# Altium project ZYNQ_Industrial_Data_Acquisition.PrjPcb (part 1 of 2)
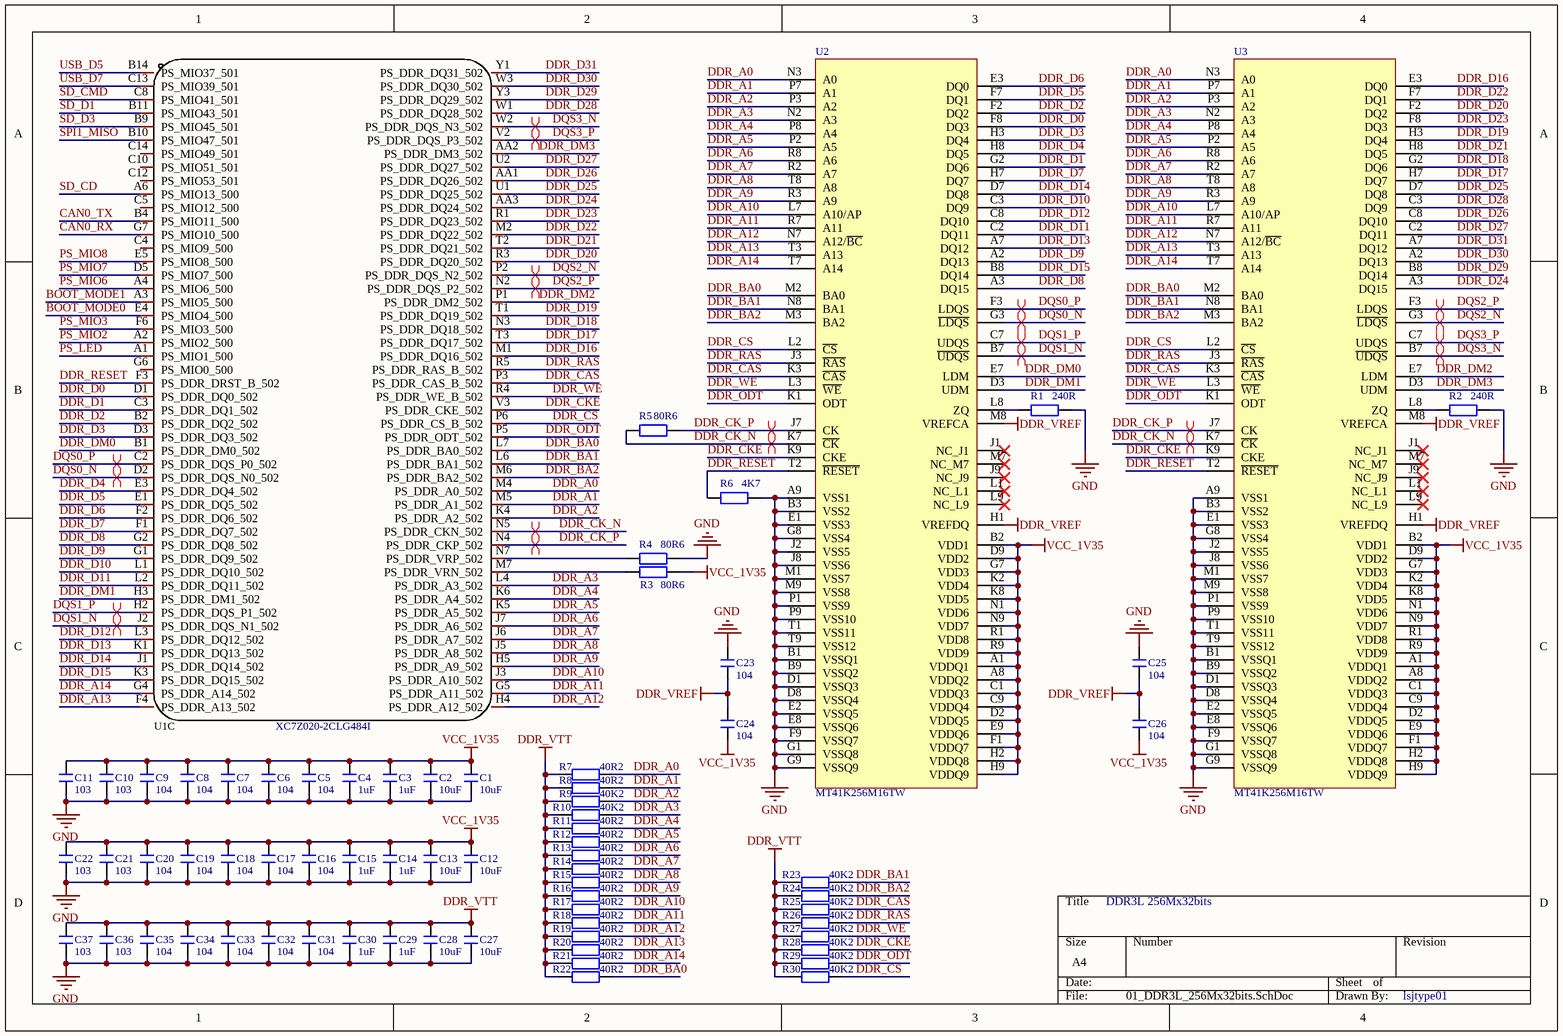
[diagram p0: 01_DDR3L_256Mx32bits.SchDoc]
10 sheets, 426 parts. Net scope: global (net labels, ports and power ports of the same name join across sheets).
Board file: IDA_Board_02_ver1.0.PcbDoc
Sheets:
  01_DDR3L_256Mx32bits.SchDoc
  02_ZYNQ_POWER.SchDoc
  03_SYS_POWER.SchDoc
  04_ZYNQ_BANK13_33_34.SchDoc
  05_ZYNQ_BANK0_1_34_35.SchDoc
  06_CAN&RS485.SchDoc
  07_FE_SWITCHING.SchDoc
  08_HDMI.SchDoc
  09_TFCARD&USB2.0.SchDoc
  10_FE_LANPORT.SchDoc

## Sheet 01_DDR3L_256Mx32bits.SchDoc
size A4; SheetNumber: 2; SheetTotal: 11

### Parts
C1  10uF  [C 0603]
C2  10uF  [C 0603]
C3  1uF  [C 0402]
C4  1uF  [C 0402]
C5  104  [C 0402]
C6  104  [C 0402]
C7  104  [C 0402]
C8  104  [C 0402]
C9  104  [C 0402]
C10  103  [C 0402]
C11  103  [C 0402]
C12  10uF  [C 0603]
C13  10uF  [C 0603]
C14  1uF  [C 0402]
C15  1uF  [C 0402]
C16  104  [C 0402]
C17  104  [C 0402]
C18  104  [C 0402]
C19  104  [C 0402]
C20  104  [C 0402]
C21  103  [C 0402]
C22  103  [C 0402]
C23  104  [C 0402]
C24  104  [C 0402]
C25  104  [C 0402]
C26  104  [C 0402]
C27  10uF  [C 0603]
C28  10uF  [C 0603]
C29  1uF  [C 0402]
C30  1uF  [C 0402]
C31  104  [C 0402]
C32  104  [C 0402]
C33  104  [C 0402]
C34  104  [C 0402]
C35  104  [C 0402]
C36  103  [C 0402]
C37  103  [C 0402]
R1  240R  [R 0402]
R2  240R  [R 0402]
R3  80R6  [R 0402]
R4  80R6  [R 0402]
R5  80R6  [R 0402]
R6  4K7  [R 0402]
R7  40R2  [R 0402]
R8  40R2  [R 0402]
R9  40K2  [R 0402]
R10  40K2  [R 0402]
R11  40R2  [R 0402]
R12  40R2  [R 0402]
R13  40R2  [R 0402]
R14  40R2  [R 0402]
R15  40R2  [R 0402]
R16  40R2  [R 0402]
R17  40R2  [R 0402]
R18  40R2  [R 0402]
R19  40R2  [R 0402]
R20  40R2  [R 0402]
R21  40R2  [R 0402]
R22  40R2  [R 0402]
R23  40K2  [R 0402]
R24  40K2  [R 0402]
R25  40K2  [R 0402]
R26  40K2  [R 0402]
R27  40K2  [R 0402]
R28  40K2  [R 0402]
R29  40K2  [R 0402]
R30  40K2  [R 0402]
U1  XC7Z020-2CLG484I  [CSPBGA-484]  (part C of 4)
U2  MT41K256M16TW  [FBGA_96]
U3  MT41K256M16TW  [FBGA_96]

### Nets
DDR_VREF: C23.2 C24.1 C25.2 C26.1 U2.H1(VREFDQ) U2.M8(VREFCA) U3.H1(VREFDQ) U3.M8(VREFCA)
DDR_VTT: C27.2 C28.1 C29.1 C30.1 C31.1 C32.1 C33.1 C34.1 C35.1 C36.1 C37.1 R7.1 R8.1 R9.1 R10.1 R11.1 R12.1 R13.1 R14.1 R15.1 R16.1 R17.1 R18.1 R19.1 R20.1 R21.1 R22.1 R23.1 R24.1 R25.1 R26.1 R27.1 R28.1 R29.1 R30.1
GND: C1.1 C2.1 C3.1 C4.1 C5.1 C6.1 C7.1 C8.1 C9.1 C10.1 C11.1 C12.1 C13.1 C14.1 C15.1 C16.1 C17.1 C18.1 C19.1 C20.1 C21.1 C22.1 C23.1 C25.1 C27.1 C28.2 C29.2 C30.2 C31.2 C32.2 C33.2 C34.2 C35.2 C36.2 C37.2 R1.2 R2.2 R4.2 R6.1 U2.A9(VSS1) U2.B1(VSSQ1) U2.B3(VSS2) U2.B9(VSSQ2) U2.D1(VSSQ3) U2.D8(VSSQ4) U2.E1(VSS3) U2.E2(VSSQ5) U2.E8(VSSQ6) U2.F9(VSSQ7) U2.G1(VSSQ8) U2.G8(VSS4) U2.G9(VSSQ9) U2.J2(VSS5) U2.J8(VSS6) U2.M1(VSS7) U2.M9(VSS8) U2.P1(VSS9) U2.P9(VSS10) U2.T1(VSS11) U2.T9(VSS12) U3.A9(VSS1) U3.B1(VSSQ1) U3.B3(VSS2) U3.B9(VSSQ2) U3.D1(VSSQ3) U3.D8(VSSQ4) U3.E1(VSS3) U3.E2(VSSQ5) U3.E8(VSSQ6) U3.F9(VSSQ7) U3.G1(VSSQ8) U3.G8(VSS4) U3.G9(VSSQ9) U3.J2(VSS5) U3.J8(VSS6) U3.M1(VSS7) U3.M9(VSS8) U3.P1(VSS9) U3.P9(VSS10) U3.T1(VSS11) U3.T9(VSS12)
VCC_1V35: C1.2 C2.2 C3.2 C4.2 C5.2 C6.2 C7.2 C8.2 C9.2 C10.2 C11.2 C12.2 C13.2 C14.2 C15.2 C16.2 C17.2 C18.2 C19.2 C20.2 C21.2 C22.2 C24.2 C26.2 R3.2 U2.A1(VDDQ1) U2.A8(VDDQ2) U2.B2(VDD1) U2.C1(VDDQ3) U2.C9(VDDQ4) U2.D2(VDDQ5) U2.D9(VDD2) U2.E9(VDDQ6) U2.F1(VDDQ7) U2.G7(VDD3) U2.H2(VDDQ8) U2.H9(VDDQ9) U2.K2(VDD4) U2.K8(VDD5) U2.N1(VDD6) U2.N9(VDD7) U2.R1(VDD8) U2.R9(VDD9) U3.A1(VDDQ1) U3.A8(VDDQ2) U3.B2(VDD1) U3.C1(VDDQ3) U3.C9(VDDQ4) U3.D2(VDDQ5) U3.D9(VDD2) U3.E9(VDDQ6) U3.F1(VDDQ7) U3.G7(VDD3) U3.H2(VDDQ8) U3.H9(VDDQ9) U3.K2(VDD4) U3.K8(VDD5) U3.N1(VDD6) U3.N9(VDD7) U3.R1(VDD8) U3.R9(VDD9)
BOOT_MODE0: U1.E4(PS_MIO4_500)
BOOT_MODE1: U1.A3(PS_MIO5_500)
CAN0_RX: U1.G7(PS_MIO10_500)
CAN0_TX: U1.B4(PS_MIO11_500)
DDR_A0: R7.2 U1.M4(PS_DDR_A0_502) U2.N3(A0) U3.N3(A0)
DDR_A1: R8.2 U1.M5(PS_DDR_A1_502) U2.P7(A1) U3.P7(A1)
DDR_A2: R9.2 U1.K4(PS_DDR_A2_502) U2.P3(A2) U3.P3(A2)
DDR_A3: R10.2 U1.L4(PS_DDR_A3_502) U2.N2(A3) U3.N2(A3)
DDR_A4: R11.2 U1.K6(PS_DDR_A4_502) U2.P8(A4) U3.P8(A4)
DDR_A5: R12.2 U1.K5(PS_DDR_A5_502) U2.P2(A5) U3.P2(A5)
DDR_A6: R13.2 U1.J7(PS_DDR_A6_502) U2.R8(A6) U3.R8(A6)
DDR_A7: R14.2 U1.J6(PS_DDR_A7_502) U2.R2(A7) U3.R2(A7)
DDR_A8: R15.2 U1.J5(PS_DDR_A8_502) U2.T8(A8) U3.T8(A8)
DDR_A9: R16.2 U1.H5(PS_DDR_A9_502) U2.R3(A9) U3.R3(A9)
DDR_A10: R17.2 U1.J3(PS_DDR_A10_502) U2.L7(A10/AP) U3.L7(A10/AP)
DDR_A11: R18.2 U1.G5(PS_DDR_A11_502) U2.R7(A11) U3.R7(A11)
DDR_A12: R19.2 U1.H4(PS_DDR_A12_502) U2.N7(A12/~{BC}) U3.N7(A12/~{BC})
DDR_A13: R20.2 U1.F4(PS_DDR_A13_502) U2.T3(A13) U3.T3(A13)
DDR_A14: R21.2 U1.G4(PS_DDR_A14_502) U2.T7(A14) U3.T7(A14)
DDR_BA0: R22.2 U1.L7(PS_DDR_BA0_502) U2.M2(BA0) U3.M2(BA0)
DDR_BA1: R23.2 U1.L6(PS_DDR_BA1_502) U2.N8(BA1) U3.N8(BA1)
DDR_BA2: R24.2 U1.M6(PS_DDR_BA2_502) U2.M3(BA2) U3.M3(BA2)
DDR_CAS: R25.2 U1.P3(PS_DDR_CAS_B_502) U2.K3(~{CAS}) U3.K3(~{CAS})
DDR_CK_N: R5.2 U1.N5(PS_DDR_CKN_502) U2.K7(~{CK}) U3.K7(~{CK})
DDR_CK_P: R5.1 U1.N4(PS_DDR_CKP_502) U2.J7(CK) U3.J7(CK)
DDR_CKE: R28.2 U1.V3(PS_DDR_CKE_502) U2.K9(CKE) U3.K9(CKE)
DDR_CS: R30.2 U1.P6(PS_DDR_CS_B_502) U2.L2(~{CS}) U3.L2(~{CS})
DDR_D0: U1.D1(PS_DDR_DQ0_502) U2.F8(DQ3)
DDR_D1: U1.C3(PS_DDR_DQ1_502) U2.G2(DQ6)
DDR_D2: U1.B2(PS_DDR_DQ2_502) U2.F2(DQ2)
DDR_D3: U1.D3(PS_DDR_DQ3_502) U2.H3(DQ4)
DDR_D4: U1.E3(PS_DDR_DQ4_502) U2.H8(DQ5)
DDR_D5: U1.E1(PS_DDR_DQ5_502) U2.F7(DQ1)
DDR_D6: U1.F2(PS_DDR_DQ6_502) U2.E3(DQ0)
DDR_D7: U1.F1(PS_DDR_DQ7_502) U2.H7(DQ7)
DDR_D8: U1.G2(PS_DDR_DQ8_502) U2.A3(DQ15)
DDR_D9: U1.G1(PS_DDR_DQ9_502) U2.A2(DQ13)
DDR_D10: U1.L1(PS_DDR_DQ10_502) U2.C3(DQ9)
DDR_D11: U1.L2(PS_DDR_DQ11_502) U2.C2(DQ11)
DDR_D12: U1.L3(PS_DDR_DQ12_502) U2.C8(DQ10)
DDR_D13: U1.K1(PS_DDR_DQ13_502) U2.A7(DQ12)
DDR_D14: U1.J1(PS_DDR_DQ14_502) U2.D7(DQ8)
DDR_D15: U1.K3(PS_DDR_DQ15_502) U2.B8(DQ14)
DDR_D16: U1.M1(PS_DDR_DQ16_502) U3.E3(DQ0)
DDR_D17: U1.T3(PS_DDR_DQ17_502) U3.H7(DQ7)
DDR_D18: U1.N3(PS_DDR_DQ18_502) U3.G2(DQ6)
DDR_D19: U1.T1(PS_DDR_DQ19_502) U3.H3(DQ4)
DDR_D20: U1.R3(PS_DDR_DQ20_502) U3.F2(DQ2)
DDR_D21: U1.T2(PS_DDR_DQ21_502) U3.H8(DQ5)
DDR_D22: U1.M2(PS_DDR_DQ22_502) U3.F7(DQ1)
DDR_D23: U1.R1(PS_DDR_DQ23_502) U3.F8(DQ3)
DDR_D24: U1.AA3(PS_DDR_DQ24_502) U3.A3(DQ15)
DDR_D25: U1.U1(PS_DDR_DQ25_502) U3.D7(DQ8)
DDR_D26: U1.AA1(PS_DDR_DQ26_502) U3.C8(DQ10)
DDR_D27: U1.U2(PS_DDR_DQ27_502) U3.C2(DQ11)
DDR_D28: U1.W1(PS_DDR_DQ28_502) U3.C3(DQ9)
DDR_D29: U1.Y3(PS_DDR_DQ29_502) U3.B8(DQ14)
DDR_D30: U1.W3(PS_DDR_DQ30_502) U3.A2(DQ13)
DDR_D31: U1.Y1(PS_DDR_DQ31_502) U3.A7(DQ12)
DDR_DM0: U1.B1(PS_DDR_DM0_502) U2.E7(LDM)
DDR_DM1: U1.H3(PS_DDR_DM1_502) U2.D3(UDM)
DDR_DM2: U1.P1(PS_DDR_DM2_502) U3.E7(LDM)
DDR_DM3: U1.AA2(PS_DDR_DM3_502) U3.D3(UDM)
DDR_ODT: R29.2 U1.P5(PS_DDR_ODT_502) U2.K1(ODT) U3.K1(ODT)
DDR_RAS: R26.2 U1.R5(PS_DDR_RAS_B_502) U2.J3(~{RAS}) U3.J3(~{RAS})
DDR_RESET: R6.2 U1.F3(PS_DDR_DRST_B_502) U2.T2(~{RESET}) U3.T2(~{RESET})
DDR_WE: R27.2 U1.R4(PS_DDR_WE_B_502) U2.L3(~{WE}) U3.L3(~{WE})
DQS0_N: U1.D2(PS_DDR_DQS_N0_502) U2.G3(~{LDQS})
DQS0_P: U1.C2(PS_DDR_DQS_P0_502) U2.F3(LDQS)
DQS1_N: U1.J2(PS_DDR_DQS_N1_502) U2.B7(~{UDQS})
DQS1_P: U1.H2(PS_DDR_DQS_P1_502) U2.C7(UDQS)
DQS2_N: U1.P2(PS_DDR_DQS_N2_502) U3.G3(~{LDQS})
DQS2_P: U1.N2(PS_DDR_DQS_P2_502) U3.F3(LDQS)
DQS3_N: U1.W2(PS_DDR_DQS_N3_502) U3.B7(~{UDQS})
DQS3_P: U1.V2(PS_DDR_DQS_P3_502) U3.C7(UDQS)
PS_LED: U1.A1(PS_MIO1_500)
PS_MIO2: U1.A2(PS_MIO2_500)
PS_MIO3: U1.F6(PS_MIO3_500)
PS_MIO6: U1.A4(PS_MIO6_500)
PS_MIO7: U1.D5(PS_MIO7_500)
PS_MIO8: U1.E5(PS_MIO8_500)
SD_CD: U1.A6(PS_MIO13_500)
SD_CMD: U1.C8(PS_MIO41_501)
SD_D1: U1.B11(PS_MIO43_501)
SD_D3: U1.B9(PS_MIO45_501)
SPI1_MISO: U1.B10(PS_MIO47_501)
USB_D5: U1.B14(PS_MIO37_501)
USB_D7: U1.C13(PS_MIO39_501)
NetR1_1: R1.1 U2.L8(ZQ)
NetR2_1: R2.1 U3.L8(ZQ)
NetR3_1: R3.1 U1.M7(PS_DDR_VRN_502)
NetR4_1: R4.1 U1.N7(PS_DDR_VRP_502)

Not connected (* = marked no-connect by the designer): U1 C4(PS_MIO9_500) C5(PS_MIO12_500) C10(PS_MIO51_501) C12(PS_MIO53_501) C14(PS_MIO49_501) G6(PS_MIO0_500); U2 J1(NC_J1)* J9(NC_J9)* L1(NC_L1)* L9(NC_L9)* M7(NC_M7)*; U3 J1(NC_J1)* J9(NC_J9)* L1(NC_L1)* L9(NC_L9)* M7(NC_M7)*

### Layout directives
differential pair: DDR_CK_N, DDR_CK_P, DQS0_N, DQS0_P, DQS1_N, DQS1_P, DQS2_N, DQS2_P, DQS3_N, DQS3_P

### Notes on the sheet
- DDR3L 256Mx32bits
- lsjtype01

### Library data of the parts
C1-C37 = C: 无极性贴片电容; 版权归属: 源创客; BOM名称: 无极性贴片电容; 学习资源: www.ooocke.com
R1-R30 = R: 贴片电阻; 版权归属: 源创客; BOM名称: 贴片电阻; 学习资源: www.ooocke.com
U1 = XC7Z020-2CLG484I: Manufacturer: XILINX(赛灵思); Add into BOM: yes; Paste Type: expand; Name: XC7Z020-2CLG484I; Symbol: XC7Z020-2CLG484I; Device: XC7Z020-2CLG484I; LCSC Part Name: XC7Z020-2CLG484I; Supplier Part: C157624; Manufacturer Part: XC7Z020-2CLG484I; Supplier Footprint: CSPBGA-484; JLCPCB Part Class: Extended Part; Datasheet: https://atta.szlcsc.com/upload/public/pdf/source/20180115/C157624_15160149665121269420.pdf; Supplier: LCSC; Convert to PCB: yes; Assembly Type: smtWeld

## Sheet 02_ZYNQ_POWER.SchDoc
size A4; SheetNumber: 3; SheetTotal: 11
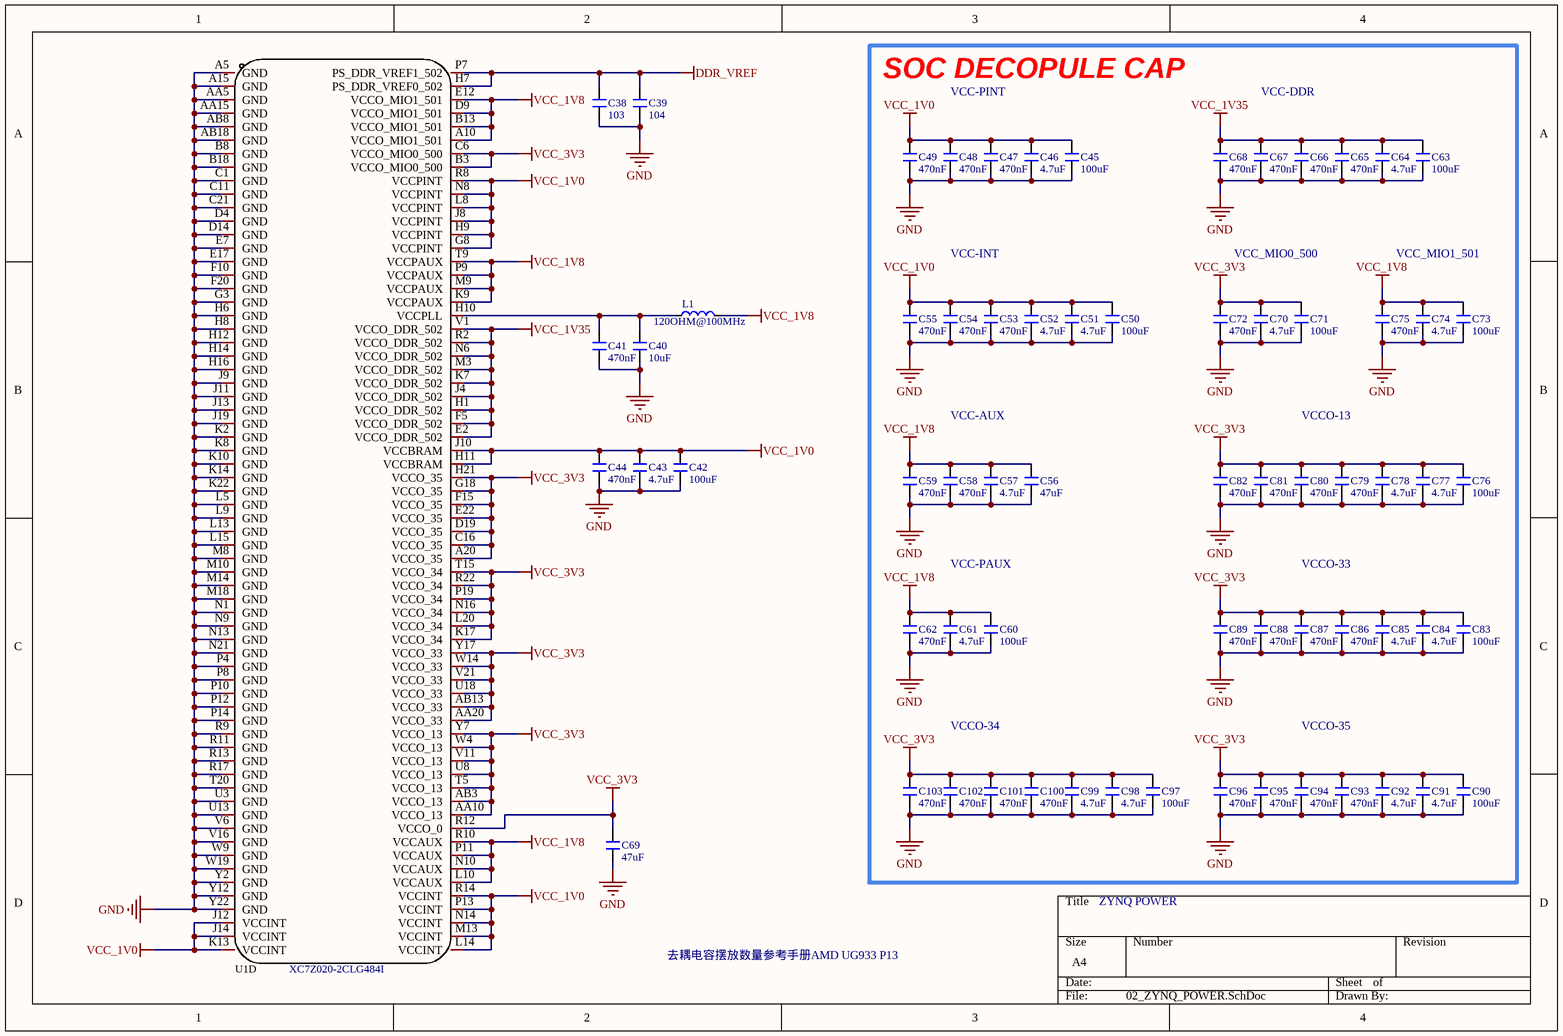
[diagram p1: 02_ZYNQ_POWER.SchDoc]

### Parts
C38  103  [C 0402]
C39  104  [C 0402]
C40  10uF  [C 0402]
C41  470nF  [C 0402]
C42  100uF  [C 0805]
C43  4.7uF  [C 0402]
C44  470nF  [C 0402]
C45  100uF  [C 0805]
C46  4.7uF  [C 0402]
C47  470nF  [C 0402]
C48  470nF  [C 0402]
C49  470nF  [C 0402]
C50  100uF  [C 0805]
C51  4.7uF  [C 0402]
C52  4.7uF  [C 0402]
C53  470nF  [C 0402]
C54  470nF  [C 0402]
C55  470nF  [C 0402]
C56  47uF  [C 0805]
C57  4.7uF  [C 0402]
C58  470nF  [C 0402]
C59  470nF  [C 0402]
C60  100uF  [C 0805]
C61  4.7uF  [C 0402]
C62  470nF  [C 0402]
C63  100uF  [C 0805]
C64  4.7uF  [C 0402]
C65  470nF  [C 0402]
C66  470nF  [C 0402]
C67  470nF  [C 0402]
C68  470nF  [C 0402]
C69  47uF  [C 0805]
C70  4.7uF  [C 0402]
C71  100uF  [C 0805]
C72  470nF  [C 0402]
C73  100uF  [C 0805]
C74  4.7uF  [C 0402]
C75  470nF  [C 0402]
C76  100uF  [C 0805]
C77  4.7uF  [C 0402]
C78  4.7uF  [C 0402]
C79  470nF  [C 0402]
C80  470nF  [C 0402]
C81  470nF  [C 0402]
C82  470nF  [C 0402]
C83  100uF  [C 0805]
C84  4.7uF  [C 0402]
C85  4.7uF  [C 0402]
C86  470nF  [C 0402]
C87  470nF  [C 0402]
C88  470nF  [C 0402]
C89  470nF  [C 0402]
C90  100uF  [C 0805]
C91  4.7uF  [C 0402]
C92  4.7uF  [C 0402]
C93  470nF  [C 0402]
C94  470nF  [C 0402]
C95  470nF  [C 0402]
C96  470nF  [C 0402]
C97  100uF  [C 0805]
C98  4.7uF  [C 0402]
C99  4.7uF  [C 0402]
C100  470nF  [C 0402]
C101  470nF  [C 0402]
C102  470nF  [C 0402]
C103  470nF  [C 0402]
L1  120OHM@100MHz  [L 0603]
U1  XC7Z020-2CLG484I  [FPBGA-484_L19.0-W19.0-R22-C22-P0.80-BL]  (part D of 4)

### Blocks framed on the sheet
SOC DECOPULE CAP: C45-C68 C70-C103

### Nets
DDR_VREF: C38.2 C39.2 U1.H7(PS_DDR_VREF0_502) U1.P7(PS_DDR_VREF1_502)
GND: C38.1 C39.1 C40.1 C41.1 C42.1 C43.1 C44.1 C45.1 C46.1 C47.1 C48.1 C49.1 C50.1 C51.1 C52.1 C53.1 C54.1 C55.1 C56.1 C57.1 C58.1 C59.1 C60.1 C61.1 C62.1 C63.1 C64.1 C65.1 C66.1 C67.1 C68.1 C69.1 C70.1 C71.1 C72.1 C73.1 C74.1 C75.1 C76.1 C77.1 C78.1 C79.1 C80.1 C81.1 C82.1 C83.1 C84.1 C85.1 C86.1 C87.1 C88.1 C89.1 C90.1 C91.1 C92.1 C93.1 C94.1 C95.1 C96.1 C97.1 C98.1 C99.1 C100.1 C101.1 C102.1 C103.1 U1.A5(GND) U1.A15(GND) U1.AA5(GND) U1.AA15(GND) U1.AB8(GND) U1.AB18(GND) U1.B8(GND) U1.B18(GND) U1.C1(GND) U1.C11(GND) U1.C21(GND) U1.D4(GND) U1.D14(GND) U1.E7(GND) U1.E17(GND) U1.F10(GND) U1.F20(GND) U1.G3(GND) U1.H6(GND) U1.H8(GND) U1.H12(GND) U1.H14(GND) U1.H16(GND) U1.J9(GND) U1.J11(GND) U1.J13(GND) U1.J19(GND) U1.K2(GND) U1.K8(GND) U1.K10(GND) U1.K14(GND) U1.K22(GND) U1.L5(GND) U1.L9(GND) U1.L13(GND) U1.L15(GND) U1.M8(GND) U1.M10(GND) U1.M14(GND) U1.M18(GND) U1.N1(GND) U1.N9(GND) U1.N13(GND) U1.N21(GND) U1.P4(GND) U1.P8(GND) U1.P10(GND) U1.P12(GND) U1.P14(GND) U1.R9(GND) U1.R11(GND) U1.R13(GND) U1.R17(GND) U1.T20(GND) U1.U3(GND) U1.U13(GND) U1.V6(GND) U1.V16(GND) U1.W9(GND) U1.W19(GND) U1.Y2(GND) U1.Y12(GND) U1.Y22(GND)
VCC_1V0: C42.2 C43.2 C44.2 C45.2 C46.2 C47.2 C48.2 C49.2 C50.2 C51.2 C52.2 C53.2 C54.2 C55.2 U1.G8(VCCPINT) U1.H9(VCCPINT) U1.H11(VCCBRAM) U1.J8(VCCPINT) U1.J10(VCCBRAM) U1.J12(VCCINT) U1.J14(VCCINT) U1.K13(VCCINT) U1.L8(VCCPINT) U1.L14(VCCINT) U1.M13(VCCINT) U1.N8(VCCPINT) U1.N14(VCCINT) U1.P13(VCCINT) U1.R8(VCCPINT) U1.R14(VCCINT)
VCC_1V8: C56.2 C57.2 C58.2 C59.2 C60.2 C61.2 C62.2 C73.2 C74.2 C75.2 L1.2 U1.A10(VCCO_MIO1_501) U1.B13(VCCO_MIO1_501) U1.D9(VCCO_MIO1_501) U1.E12(VCCO_MIO1_501) U1.K9(VCCPAUX) U1.L10(VCCAUX) U1.M9(VCCPAUX) U1.N10(VCCAUX) U1.P9(VCCPAUX) U1.P11(VCCAUX) U1.R10(VCCAUX) U1.T9(VCCPAUX)
VCC_1V35: C63.2 C64.2 C65.2 C66.2 C67.2 C68.2 U1.E2(VCCO_DDR_502) U1.F5(VCCO_DDR_502) U1.H1(VCCO_DDR_502) U1.J4(VCCO_DDR_502) U1.K7(VCCO_DDR_502) U1.M3(VCCO_DDR_502) U1.N6(VCCO_DDR_502) U1.R2(VCCO_DDR_502) U1.V1(VCCO_DDR_502)
VCC_3V3: C69.2 C70.2 C71.2 C72.2 C76.2 C77.2 C78.2 C79.2 C80.2 C81.2 C82.2 C83.2 C84.2 C85.2 C86.2 C87.2 C88.2 C89.2 C90.2 C91.2 C92.2 C93.2 C94.2 C95.2 C96.2 C97.2 C98.2 C99.2 C100.2 C101.2 C102.2 C103.2 U1.A20(VCCO_35) U1.AA10(VCCO_13) U1.AA20(VCCO_33) U1.AB3(VCCO_13) U1.AB13(VCCO_33) U1.B3(VCCO_MIO0_500) U1.C6(VCCO_MIO0_500) U1.C16(VCCO_35) U1.D19(VCCO_35) U1.E22(VCCO_35) U1.F15(VCCO_35) U1.G18(VCCO_35) U1.H21(VCCO_35) U1.K17(VCCO_34) U1.L20(VCCO_34) U1.N16(VCCO_34) U1.P19(VCCO_34) U1.R12(VCCO_0) U1.R22(VCCO_34) U1.T5(VCCO_13) U1.T15(VCCO_34) U1.U8(VCCO_13) U1.U18(VCCO_33) U1.V11(VCCO_13) U1.V21(VCCO_33) U1.W4(VCCO_13) U1.W14(VCCO_33) U1.Y7(VCCO_13) U1.Y17(VCCO_33)
NetC40_2: C40.2 C41.2 L1.1 U1.H10(VCCPLL)

### Notes on the sheet
- VCC-PINT
- VCC-DDR
- VCC-INT
- VCC_MIO0_500
- VCC_MIO1_501
- VCC-AUX
- VCCO-13
- VCC-PAUX
- VCCO-33
- VCCO-34
- VCCO-35
- ZYNQ POWER
- 去耦电容摆放数量参考手册AMD UG933 P13

### Library data of the parts
C38-C103 = C: 无极性贴片电容; 版权归属: 源创客; BOM名称: 无极性贴片电容; 学习资源: www.ooocke.com
L1 = L: 小功率贴片电感磁珠; 版权归属: 源创客; BOM名称: 小功率贴片电感; 学习资源: www.ooocke.com
U1 = XC7Z020-2CLG484I: as U1 on sheet 01_DDR3L_256Mx32bits; Name: XC7Z020-2CLG484I; Symbol: XC7Z020-2CLG484I; Device: XC7Z020-2CLG484I; LCSC Part Name: XC7Z020-2CLG484I; Supplier Part: C157624; Manufacturer Part: XC7Z020-2CLG484I; Supplier Footprint: CSPBGA-484; JLCPCB Part Class: Extended Part; Datasheet: https://atta.szlcsc.com/upload/public/pdf/source/20180115/C157624_15160149665121269420.pdf; Supplier: LCSC; Convert to PCB: yes; Assembly Type: smtWeld

## Sheet 03_SYS_POWER.SchDoc
size A4; SheetNumber: 4; SheetTotal: 11
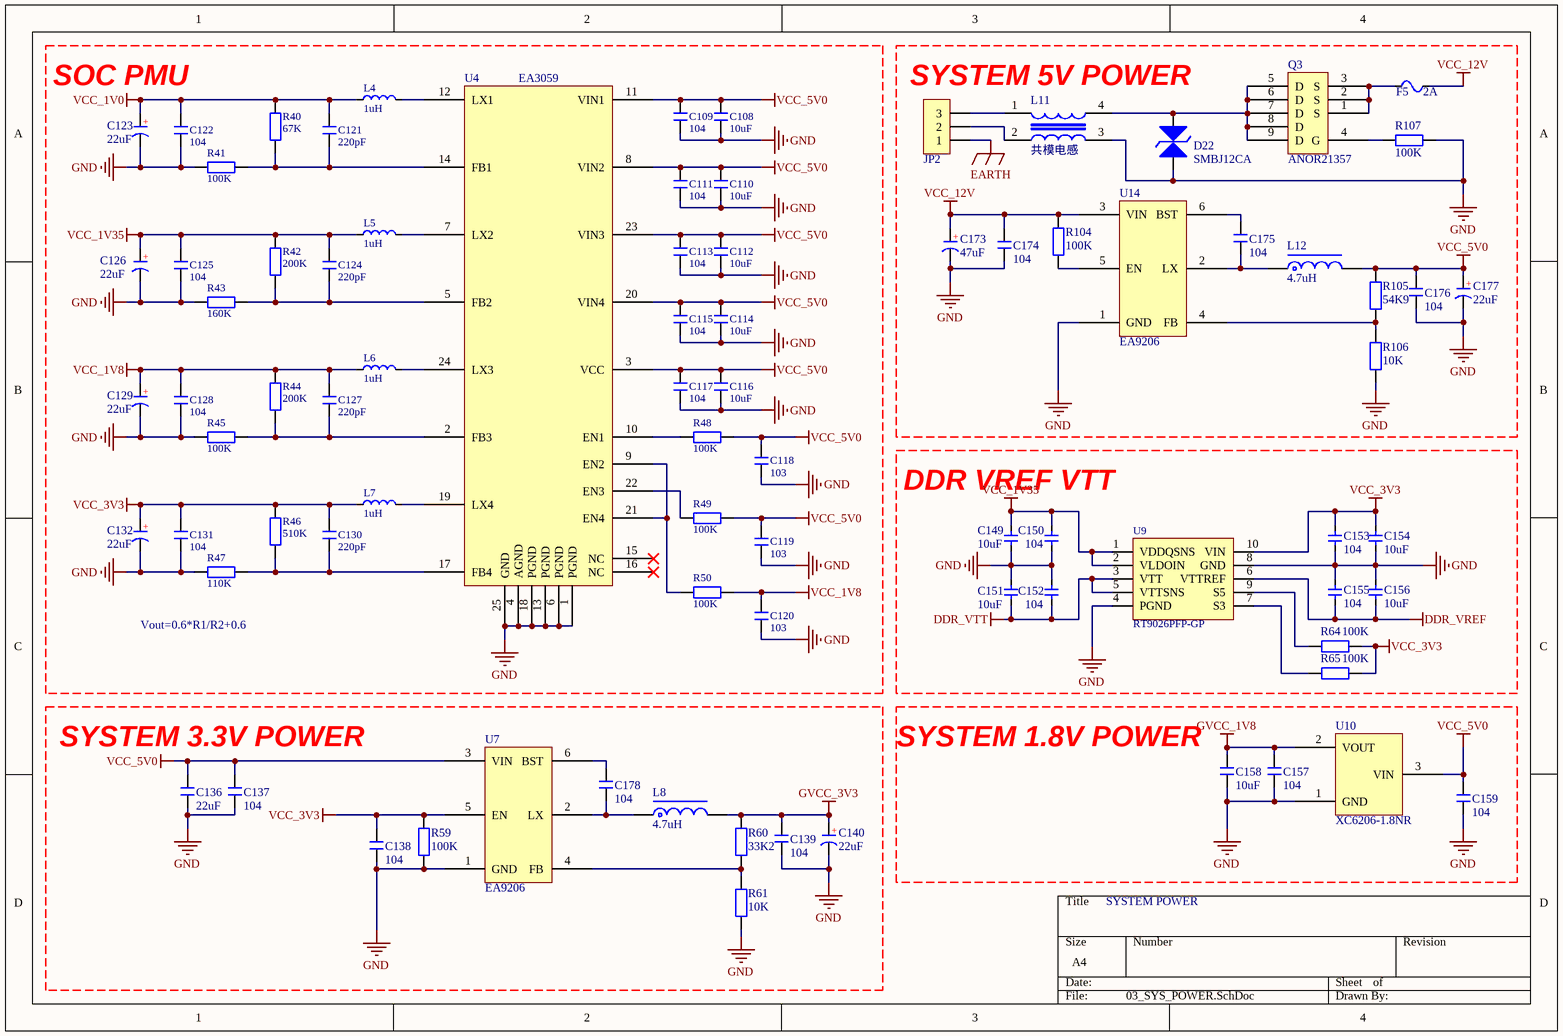
[diagram p2: 03_SYS_POWER.SchDoc]

### Parts
C108  10uF  [C 0805]
C109  104  [C 0603]
C110  10uF  [C 0805]
C111  104  [C 0603]
C112  10uF  [C 0805]
C113  104  [C 0603]
C114  10uF  [C 0805]
C115  104  [C 0603]
C116  10uF  [C 0805]
C117  104  [C 0603]
C118  103  [C 0603]
C119  103  [C 0603]
C120  103  [C 0603]
C121  220pF  [C 0603]
C122  104  [C 0603]
C123  22uF  [CD A(3216)]
C124  220pF  [C 0603]
C125  104  [C 0603]
C126  22uF  [CD A(3216)]
C127  220pF  [C 0603]
C128  104  [C 0603]
C129  22uF  [CD A(3216)]
C130  220pF  [C 0603]
C131  104  [C 0603]
C132  22uF  [CD A(3216)]
C136  22uF  [C 0805]
C137  104  [C 0603]
C138  104  [C 0603]
C139  104  [C 0603]
C140  22uF  [CD A(3216)]
C149  10uF  [C 0603]
C150  104  [C 0603]
C151  10uF  [C 0603]
C152  104  [C 0603]
C153  104  [C 0603]
C154  10uF  [C 0603]
C155  104  [C 0603]
C156  10uF  [C 0603]
C157  104  [C 0603]
C158  10uF  [C 0603]
C159  104  [C 0603]
C173  47uF  [CM C(5*5.4)]
C174  104  [C 0603]
C175  104  [C 0603]
C176  104  [C 0603]
C177  22uF  [CD A(3216)]
C178  104  [C 0603]
D22  SMBJ12CA  [SMB]
F5  2A  [PLCC-1812]
JP2  HDR-1X3  [KF2EDGE_3.81_3P]  (value not drawn)
L4  1uH  [L_2520]
L5  1uH  [L_2520]
L6  1uH  [L_2520]
L7  1uH  [L_2520]
L8  4.7uH  [L-SMD-0420]
L11  共模电感  [ACM7060]
L12  4.7uH  [L-SMD-0420]
Q3  ANOR21357  [DFN-8]
R40  67K  [R 0603]
R41  100K  [R 0603]
R42  200K  [R 0603]
R43  160K  [R 0603]
R44  200K  [R 0603]
R45  100K  [R 0603]
R46  510K  [R 0603]
R47  110K  [R 0603]
R48  100K  [R 0603]
R49  100K  [R 0603]
R50  100K  [R 0603]
R59  100K  [R 0603]
R60  33K2  [R 0603]
R61  10K  [R 0603]
R64  100K  [R 0603]
R65  100K  [R 0603]
R104  100K  [R 0603]
R105  54K9  [R 0603]
R106  10K  [R 0603]
R107  100K  [R 0603]
U4  EA3059  [QFN-24 14x14]
U7  EA9206  [SOT23-6L]
U9  RT9026PFP-GP  [MSOP10_PAD]
U10  XC6206-1.8NR  [SOT23-3M]
U14  EA9206  [SOT23-6L]

### Nets
DDR_VREF: C155.1 C156.1 U9.6(VTTREF)
DDR_VTT: C151.1 C152.1 U9.3(VTT) U9.5(VTTSNS)
EARTH: JP2.1
GND: C108.1 C109.1 C110.1 C111.1 C112.1 C113.1 C114.1 C115.1 C116.1 C117.1 C118.2 C119.1 C120.1 C122.1 C123.2(K) C125.1 C126.2(K) C128.1 C129.2(K) C131.1 C132.2(K) C136.1 C137.1 C138.1 C139.1 C140.2(K) C149.1 C150.1 C151.2 C152.2 C153.1 C154.1 C155.2 C156.2 C157.1 C158.1 C159.1 C173.2(K) C174.1 C176.1 C177.2(K) D22.1(A) L11.3 R41.2 R43.2 R45.2 R47.2 R59.2 R61.1 R106.1 R107.1 U4.1(PGND) U4.4(AGND) U4.6(PGND) U4.13(PGND) U4.18(PGND) U4.25(GND) U7.1(GND) U9.4(PGND) U9.8(GND) U9.11(PAD) U10.1(GND) U14.1(GND)
GVCC_1V8: C157.2 C158.2 U10.2(VOUT)
GVCC_3V3: C139.2 C140.1(A) L8.2 R60.2
VCC_1V0: C121.2 C122.2 C123.1(A) L4.1 R40.2
VCC_1V8: C120.2 C127.2 C128.2 C129.1(A) L6.1 R44.2 R50.2
VCC_1V35: C124.2 C125.2 C126.1(A) C149.2 C150.2 L5.1 R42.2 U9.1(VDDQSNS) U9.2(VLDOIN)
VCC_3V3: C130.2 C131.2 C132.1(A) C138.2 C153.2 C154.2 L7.1 R46.2 R59.1 R64.2 R65.2 U7.5(EN) U9.10(VIN)
VCC_5V0: C108.2 C109.2 C110.2 C111.2 C112.2 C113.2 C114.2 C115.2 C116.2 C117.2 C118.1 C119.2 C136.2 C137.2 C159.2 C176.2 C177.1(A) L12.2 R48.2 R49.2 R105.2 U4.3(VCC) U4.8(VIN2) U4.11(VIN1) U4.20(VIN4) U4.23(VIN3) U7.3(VIN) U10.3(VIN)
VCC_12V: C173.1(A) C174.2 F5.2 R104.2 U14.3(VIN)
NetC121_1: C121.1 R40.1 R41.1 U4.14(FB1)
NetC124_1: C124.1 R42.1 R43.1 U4.5(FB2)
NetC127_1: C127.1 R44.1 R45.1 U4.2(FB3)
NetC130_1: C130.1 R46.1 R47.1 U4.17(FB4)
NetC175_1: C175.1 L12.1 U14.2(LX)
NetC175_2: C175.2 U14.6(BST)
NetC178_1: C178.1 L8.1 U7.2(LX)
NetC178_2: C178.2 U7.6(BST)
NetD22_2: D22.2(K) L11.4 Q3.5(D) Q3.6(D) Q3.7(D) Q3.8(D) Q3.9(D)
NetF5_1: F5.1 Q3.1(S) Q3.2(S) Q3.3(S)
NetJP2_2: JP2.2 L11.2
NetJP2_3: JP2.3 L11.1
NetL4_2: L4.2 U4.12(LX1)
NetL5_2: L5.2 U4.7(LX2)
NetL6_2: L6.2 U4.24(LX3)
NetL7_2: L7.2 U4.19(LX4)
NetQ3_4: Q3.4(G) R107.2
NetR48_1: R48.1 U4.10(EN1)
NetR49_1: R49.1 U4.22(EN3)
NetR50_1: R50.1 U4.9(EN2) U4.21(EN4)
NetR60_1: R60.1 R61.2 U7.4(FB)
NetR64_1: R64.1 U9.9(S5)
NetR65_1: R65.1 U9.7(S3)
NetR104_1: R104.1 U14.5(EN)
NetR105_1: R105.1 R106.2 U14.4(FB)

Not connected (* = marked no-connect by the designer): U4 15(NC)* 16(NC)*

### Notes on the sheet
- SOC PMU
- SYSTEM 5V POWER
- DDR VREF VTT
- (near R47) Vout=0.6*R1/R2+0.6
- SYSTEM 3.3V POWER
- SYSTEM 1.8V POWER
- SYSTEM POWER
- (in symbol C-CM) +

### Library data of the parts
C108-C122 C124 C125 C127 C128 C130 C131 C136-C139 C157-C159 C174-C176 C178 = C: 无极性贴片电容; 版权归属: 源创客; BOM名称: 无极性贴片电容; 学习资源: www.ooocke.com
C123 C126 C129 C132 C140 C173 C177 = C-CM: 贴片电解电容; 版权归属: 源创客; BOM名称: 贴片电解电容; 学习资源: www.ooocke.com
C149-C156 = 电容-0402: Capacitor; Value: 0.1u
D22 = TVS
F5 = FU: 贴片保险丝; 版权归属: 源创客; BOM名称: 贴片保险丝; 学习资源: www.ooocke.com
JP2 = Header 3: 3P接插件; 版权归属: 源创客; BOM名称: 3P接插件; 学习资源: www.ooocke.com
L4-L7 = L: 小功率贴片电感磁珠; 版权归属: 源创客; BOM名称: 小功率贴片电感; 学习资源: www.ooocke.com
L8 L12 = L-CDRH: 功率屏蔽电感; 版权归属: 源创客; BOM名称: 功率屏蔽电感; 学习资源: www.ooocke.com
Q3 = AONR21357
R40-R50 R59-R61 R64 R65 R104-R107 = R: 贴片电阻; 版权归属: 源创客; BOM名称: 贴片电阻; 学习资源: www.ooocke.com
U7 U14 = EA9206: DC-DC 3A输出
U9 = LDO RT9026: DDR 终端稳压器

## Sheet 04_ZYNQ_BANK13_33_34.SchDoc
size A4; SheetNumber: 5; SheetTotal: 11
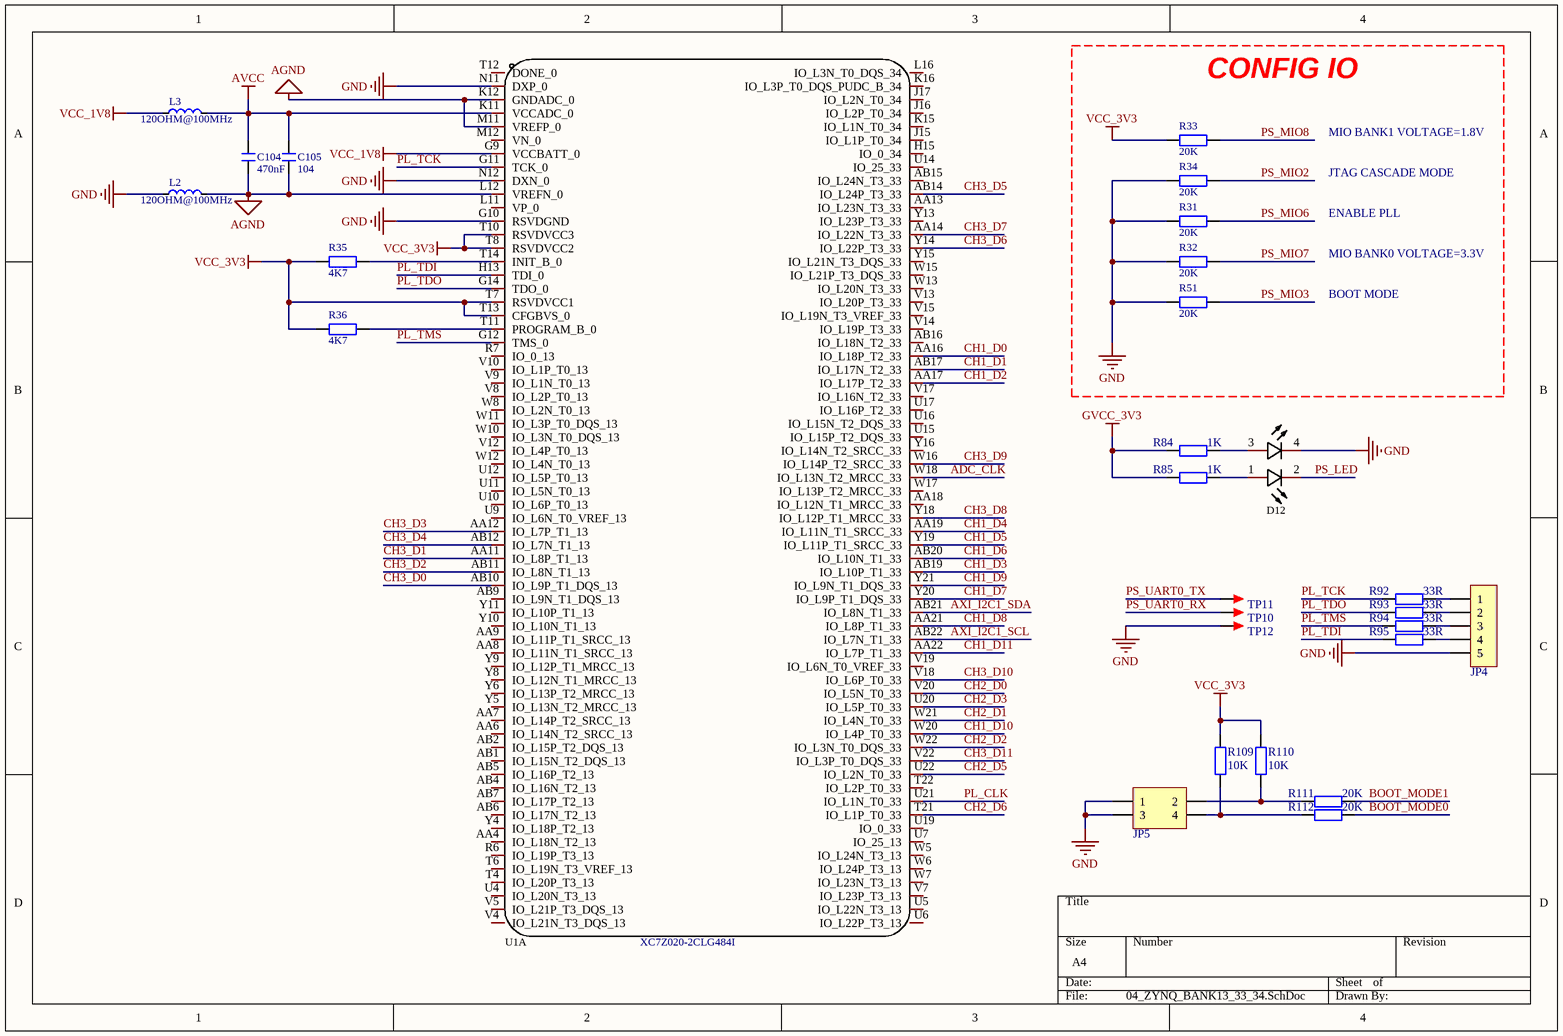
[diagram p3: 04_ZYNQ_BANK13_33_34.SchDoc]

### Parts
C104  470nF  [C 0402]
C105  104  [C 0402]
D12  A694B/2SYG/S530-E2  [Dual-LED]  (value not drawn)
JP4  HDR-1X5  [XH2.54-LI-5P]  (value not drawn)
JP5  Header2X2  [HDR2.54-LI-2x2P]  (value not drawn)
L2  120OHM@100MHz  [L 0603]
L3  120OHM@100MHz  [L 0603]
R31  20K  [R 0402]
R32  20K  [R 0402]
R33  20K  [R 0402]
R34  20K  [R 0402]
R35  4K7  [R 0402]
R36  4K7  [R 0402]
R51  20K  [R 0402]
R84  1K  [R 0603]
R85  1K  [R 0603]
R92  33R  [R 0603]
R93  33R  [R 0603]
R94  33R  [R 0603]
R95  33R  [R 0603]
R109  10K  [R 0603]
R110  10K  [R 0603]
R111  20K  [R 0603]
R112  20K  [R 0603]
TP10  TEST  [TEST 1]  (value not drawn)
TP11  TEST  [TEST 1]  (value not drawn)
TP12  TEST  [TEST 1]  (value not drawn)
U1  XC7Z020-2CLG484I  [FPBGA-484_L19.0-W19.0-R22-C22-P0.80-BL]  (part A of 4)

### Nets
AGND: C104.1 C105.1 L2.2 U1.K12(GNDADC_0) U1.L12(VREFN_0) U1.M11(VREFP_0)
AVCC: C104.2 C105.2 L3.2 U1.K11(VCCADC_0)
GND: D12.4(K2) JP4.5 JP5.1 JP5.3 L2.1 R31.1 R32.1 R34.1 R51.1 TP12.1 U1.G10(RSVDGND) U1.N11(DXP_0) U1.N12(DXN_0)
GVCC_3V3: R84.1 R85.1
VCC_1V8: L3.1 U1.G9(VCCBATT_0)
VCC_3V3: R33.1 R35.1 R36.1 R109.1 R110.1 U1.T7(RSVDVCC1) U1.T8(RSVDVCC2) U1.T10(RSVDVCC3) U1.T13(CFGBVS_0)
ADC_CLK: U1.W18(IO_L13N_T2_MRCC_33)
AXI_I2C1_SCL: U1.AB22(IO_L7N_T1_33)
AXI_I2C1_SDA: U1.AB21(IO_L8N_T1_33)
BOOT_MODE0: R112.1
BOOT_MODE1: R111.1
CH1_D0: U1.AA16(IO_L18P_T2_33)
CH1_D1: U1.AB17(IO_L17N_T2_33)
CH1_D2: U1.AA17(IO_L17P_T2_33)
CH1_D3: U1.AB19(IO_L10P_T1_33)
CH1_D4: U1.AA19(IO_L11N_T1_SRCC_33)
CH1_D5: U1.Y19(IO_L11P_T1_SRCC_33)
CH1_D6: U1.AB20(IO_L10N_T1_33)
CH1_D7: U1.Y20(IO_L9P_T1_DQS_33)
CH1_D8: U1.AA21(IO_L8P_T1_33)
CH1_D9: U1.Y21(IO_L9N_T1_DQS_33)
CH1_D10: U1.W20(IO_L4P_T0_33)
CH1_D11: U1.AA22(IO_L7P_T1_33)
CH2_D0: U1.V20(IO_L5N_T0_33)
CH2_D1: U1.W21(IO_L4N_T0_33)
CH2_D2: U1.W22(IO_L3N_T0_DQS_33)
CH2_D3: U1.U20(IO_L5P_T0_33)
CH2_D5: U1.U22(IO_L2N_T0_33)
CH2_D6: U1.T21(IO_L1P_T0_33)
CH3_D0: U1.AB10(IO_L9P_T1_DQS_13)
CH3_D1: U1.AA11(IO_L8P_T1_13)
CH3_D2: U1.AB11(IO_L8N_T1_13)
CH3_D3: U1.AA12(IO_L7P_T1_13)
CH3_D4: U1.AB12(IO_L7N_T1_13)
CH3_D5: U1.AB14(IO_L24P_T3_33)
CH3_D6: U1.Y14(IO_L22P_T3_33)
CH3_D7: U1.AA14(IO_L22N_T3_33)
CH3_D8: U1.Y18(IO_L12P_T1_MRCC_33)
CH3_D9: U1.W16(IO_L14P_T2_SRCC_33)
CH3_D10: U1.V18(IO_L6P_T0_33)
CH3_D11: U1.V22(IO_L3P_T0_DQS_33)
PL_CLK: U1.U21(IO_L1N_T0_33)
PL_TCK: R92.1 U1.G11(TCK_0)
PL_TDI: R95.1 U1.H13(TDI_0)
PL_TDO: R93.1 U1.G14(TDO_0)
PL_TMS: R94.1 U1.G12(TMS_0)
PS_LED: D12.2(K1)
PS_MIO2: R34.2
PS_MIO3: R51.2
PS_MIO6: R31.2
PS_MIO7: R32.2
PS_MIO8: R33.2
PS_UART0_RX: TP10.1
PS_UART0_TX: TP11.1
NetD12_1: D12.1(A1) R85.2
NetD12_3: D12.3(A2) R84.2
NetJP4_1: JP4.1 R92.2
NetJP4_2: JP4.2 R93.2
NetJP4_3: JP4.3 R94.2
NetJP4_4: JP4.4 R95.2
NetJP5_2: JP5.2 R110.2 R111.2
NetJP5_4: JP5.4 R109.2 R112.2
NetR35_2: R35.2 U1.T14(INIT_B_0)
NetR36_2: R36.2 U1.T11(PROGRAM_B_0)

Not connected (* = marked no-connect by the designer): U1 AA4(IO_L18N_T2_13) AA6(IO_L14N_T2_SRCC_13) AA7(IO_L14P_T2_SRCC_13) AA8(IO_L11N_T1_SRCC_13) AA9(IO_L11P_T1_SRCC_13) AA13(IO_L23N_T3_33) AA18(IO_L12N_T1_MRCC_33) AB1(IO_L15N_T2_DQS_13) AB2(IO_L15P_T2_DQS_13) AB4(IO_L16N_T2_13) AB5(IO_L16P_T2_13) AB6(IO_L17N_T2_13) AB7(IO_L17P_T2_13) AB9(IO_L9N_T1_DQS_13) AB15(IO_L24N_T3_33) AB16(IO_L18N_T2_33) H15(IO_0_34) J15(IO_L1P_T0_34) J16(IO_L2P_T0_34) J17(IO_L2N_T0_34) K15(IO_L1N_T0_34) K16(IO_L3P_T0_DQS_PUDC_B_34) L11(VP_0) L16(IO_L3N_T0_DQS_34) M12(VN_0) R6(IO_L19P_T3_13) R7(IO_0_13) T4(IO_L20P_T3_13) T6(IO_L19N_T3_VREF_13) T12(DONE_0) T22(IO_L2P_T0_33) U4(IO_L20N_T3_13) U5(IO_L22N_T3_13) U6(IO_L22P_T3_13) U7(IO_25_13) U9(IO_L6N_T0_VREF_13) U10(IO_L6P_T0_13) U11(IO_L5N_T0_13) U12(IO_L5P_T0_13) U14(IO_25_33) U15(IO_L15P_T2_DQS_33) U16(IO_L15N_T2_DQS_33) U17(IO_L16P_T2_33) U19(IO_0_33) V4(IO_L21N_T3_DQS_13) V5(IO_L21P_T3_DQS_13) V7(IO_L23P_T3_13) V8(IO_L2P_T0_13) V9(IO_L1N_T0_13) V10(IO_L1P_T0_13) V12(IO_L4P_T0_13) V13(IO_L20P_T3_33) V14(IO_L19P_T3_33) V15(IO_L19N_T3_VREF_33) V17(IO_L16N_T2_33) V19(IO_L6N_T0_VREF_33) W5(IO_L24N_T3_13) W6(IO_L24P_T3_13) W7(IO_L23N_T3_13) W8(IO_L2N_T0_13) W10(IO_L3N_T0_DQS_13) W11(IO_L3P_T0_DQS_13) W12(IO_L4N_T0_13) W13(IO_L20N_T3_33) W15(IO_L21P_T3_DQS_33) W17(IO_L13P_T2_MRCC_33) Y4(IO_L18P_T2_13) Y5(IO_L13N_T2_MRCC_13) Y6(IO_L13P_T2_MRCC_13) Y8(IO_L12N_T1_MRCC_13) Y9(IO_L12P_T1_MRCC_13) Y10(IO_L10N_T1_13) Y11(IO_L10P_T1_13) Y13(IO_L23P_T3_33) Y15(IO_L21N_T3_DQS_33) Y16(IO_L14N_T2_SRCC_33)

### Notes on the sheet
- CONFIG IO
- MIO BANK1 VOLTAGE=1.8V
- JTAG CASCADE MODE
- ENABLE PLL
- MIO BANK0 VOLTAGE=3.3V
- BOOT MODE

### Library data of the parts
C104 C105 = C: 无极性贴片电容; 版权归属: 源创客; BOM名称: 无极性贴片电容; 学习资源: www.ooocke.com
D12 = A694B/2SYG/S530-E2: Manufacturer: EVERLIGHT(亿光); Add into BOM: yes; Emitted Color: 普绿/黄绿; Lens Color: 绿色; Dominant Wavelength: 573nm; Peak Wavelength: 575nm; Forward Current: 25mA; Power Dissipation: 60mW; Lamp Holder Type: 组装式圆形灯头; Name: A694B/2SYG/S530-E2; Symbol: A694B/2SYG/S530-E2; Device: A694B/2SYG/S530-E2; LCSC Part Name: A694B/2SYG/S530-E2; Supplier Part: C93880; Manufacturer Part: A694B/2SYG/S530-E2; Supplier Footprint: 插件; JLCPCB Part Class: Extended Part; Datasheet: https://atta.szlcsc.com/upload/public/pdf/source/20170116/1484561287996.pdf; Supplier: LCSC; Convert to PCB: yes; Diode Configuration: -; Color Temperature: -; Viewing Angle: -; Mounting Sytle: -; Operating Temperature: -40℃~+85℃
JP4 = Header 5: 5P接插件; 版权归属: 源创客; BOM名称: 5P接插件; 学习资源: www.ooocke.com
JP5 = Header 2X2: 2*2P接插件; 版权归属: 源创客; BOM名称: 2*2P接插件; 学习资源: www.ooocke.com
L2 L3 = L: 小功率贴片电感磁珠; 版权归属: 源创客; BOM名称: 小功率贴片电感; 学习资源: www.ooocke.com
R31-R36 R51 R84 R85 R92-R95 R109-R112 = R: 贴片电阻; 版权归属: 源创客; BOM名称: 贴片电阻; 学习资源: www.ooocke.com
TP10-TP12 = TEST: 测试点; 版权归属: 源创客; BOM名称: 测试点; 学习资源: www.ooocke.com
U1 = XC7Z020-2CLG484I: as U1 on sheet 01_DDR3L_256Mx32bits; Name: XC7Z020-2CLG484I; Symbol: XC7Z020-2CLG484I; Device: XC7Z020-2CLG484I; LCSC Part Name: XC7Z020-2CLG484I; Supplier Part: C157624; Manufacturer Part: XC7Z020-2CLG484I; Supplier Footprint: CSPBGA-484; JLCPCB Part Class: Extended Part; Datasheet: https://atta.szlcsc.com/upload/public/pdf/source/20180115/C157624_15160149665121269420.pdf; Supplier: LCSC; Convert to PCB: yes; Assembly Type: smtWeld

## Sheet 05_ZYNQ_BANK0_1_34_35.SchDoc
size A4; SheetNumber: 6; SheetTotal: 11
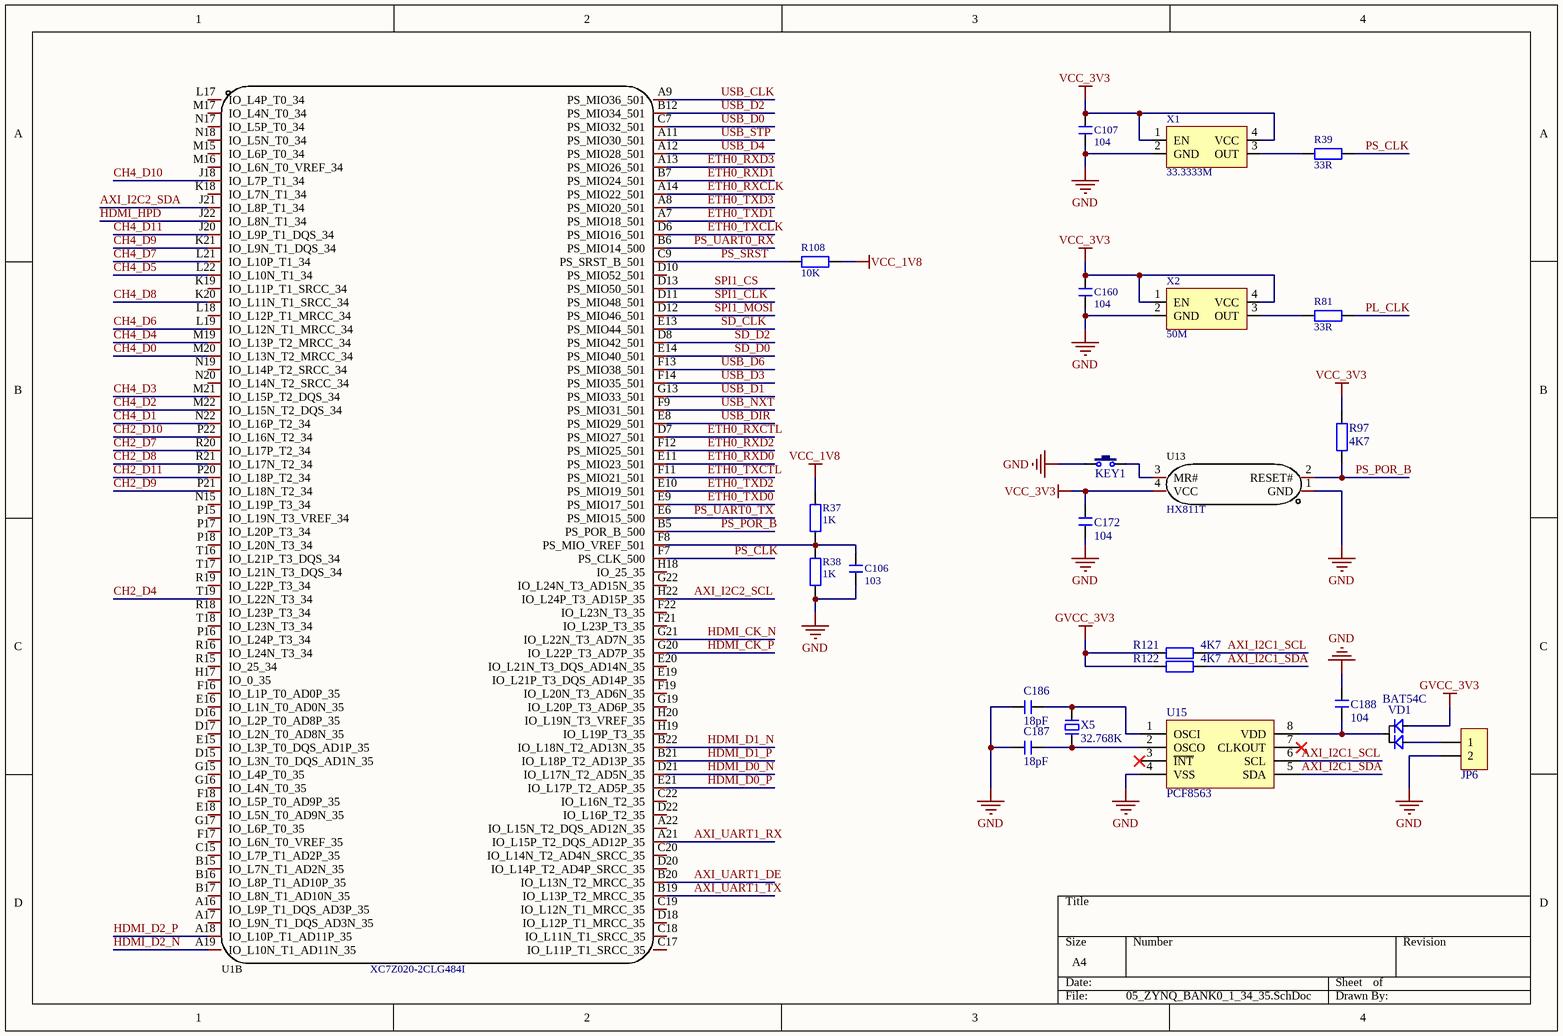
[diagram p4: 05_ZYNQ_BANK0_1_34_35.SchDoc]

### Parts
C106  103  [C 0402]
C107  104  [C 0402]
C160  104  [C 0402]
C172  104  [C 0402]
C186  18pF  [C 0603]
C187  18pF  [C 0603]
C188  104  [C 0603]
JP6  HDR-1X2  [SH1.0]  (value not drawn)
KEY1  KEY  [ButtonTACT_3x4x2_180]  (value not drawn)
R37  1K  [R 0402]
R38  1K  [R 0402]
R39  33R  [R 0402]
R81  33R  [R 0402]
R97  4K7  [R 0402]
R108  10K  [R 0402]
R121  4K7  [R 0603]
R122  4K7  [R 0603]
U1  XC7Z020-2CLG484I  [FPBGA-484_L19.0-W19.0-R22-C22-P0.80-BL]  (part B of 4)
U13  HX811T  [SOT143]
U15  PCF8563  [SOP8_N]
VD1  BAT54C  [SOT23-3N]
X1  33.3333M  [XTAL-3225 - S]
X2  50M  [XTAL-3225 - S]
X5  32.768K  [XTAL-3215]

### Nets
GND: C106.1 C107.1 C160.1 C172.1 C186.2 C187.2 C188.2 JP6.2 KEY1.1 R38.1 U13.1(GND) U15.4(VSS) X1.2(GND) X2.2(GND)
GVCC_3V3: R121.1 R122.1 VD1.2
VCC_1V8: R37.2 R108.1
VCC_3V3: C107.2 C160.2 C172.2 R97.2 U13.4(VCC) X1.1(EN) X1.4(VCC) X2.1(EN) X2.4(VCC)
AXI_I2C1_SCL: R121.2 U15.6(SCL)
AXI_I2C1_SDA: R122.2 U15.5(SDA)
AXI_I2C2_SCL: U1.H22(IO_L24P_T3_AD15P_35)
AXI_I2C2_SDA: U1.J21(IO_L8P_T1_34)
AXI_UART1_DE: U1.B20(IO_L13N_T2_MRCC_35)
AXI_UART1_RX: U1.A21(IO_L15P_T2_DQS_AD12P_35)
AXI_UART1_TX: U1.B19(IO_L13P_T2_MRCC_35)
CH2_D4: U1.T19(IO_L22N_T3_34)
CH2_D7: U1.R20(IO_L17P_T2_34)
CH2_D8: U1.R21(IO_L17N_T2_34)
CH2_D9: U1.P21(IO_L18N_T2_34)
CH2_D10: U1.P22(IO_L16N_T2_34)
CH2_D11: U1.P20(IO_L18P_T2_34)
CH4_D0: U1.M20(IO_L13N_T2_MRCC_34)
CH4_D1: U1.N22(IO_L16P_T2_34)
CH4_D2: U1.M22(IO_L15N_T2_DQS_34)
CH4_D3: U1.M21(IO_L15P_T2_DQS_34)
CH4_D4: U1.M19(IO_L13P_T2_MRCC_34)
CH4_D5: U1.L22(IO_L10N_T1_34)
CH4_D6: U1.L19(IO_L12N_T1_MRCC_34)
CH4_D7: U1.L21(IO_L10P_T1_34)
CH4_D8: U1.K20(IO_L11N_T1_SRCC_34)
CH4_D9: U1.K21(IO_L9N_T1_DQS_34)
CH4_D10: U1.J18(IO_L7P_T1_34)
CH4_D11: U1.J20(IO_L9P_T1_DQS_34)
ETH0_RXCLK: U1.A14(PS_MIO22_501)
ETH0_RXCTL: U1.D7(PS_MIO27_501)
ETH0_RXD0: U1.E11(PS_MIO23_501)
ETH0_RXD1: U1.B7(PS_MIO24_501)
ETH0_RXD2: U1.F12(PS_MIO25_501)
ETH0_RXD3: U1.A13(PS_MIO26_501)
ETH0_TXCLK: U1.D6(PS_MIO16_501)
ETH0_TXCTL: U1.F11(PS_MIO21_501)
ETH0_TXD0: U1.E9(PS_MIO17_501)
ETH0_TXD1: U1.A7(PS_MIO18_501)
ETH0_TXD2: U1.E10(PS_MIO19_501)
ETH0_TXD3: U1.A8(PS_MIO20_501)
HDMI_CK_N: U1.G21(IO_L22N_T3_AD7N_35)
HDMI_CK_P: U1.G20(IO_L22P_T3_AD7P_35)
HDMI_D0_N: U1.D21(IO_L17N_T2_AD5N_35)
HDMI_D0_P: U1.E21(IO_L17P_T2_AD5P_35)
HDMI_D1_N: U1.B22(IO_L18N_T2_AD13N_35)
HDMI_D1_P: U1.B21(IO_L18P_T2_AD13P_35)
HDMI_D2_N: U1.A19(IO_L10N_T1_AD11N_35)
HDMI_D2_P: U1.A18(IO_L10P_T1_AD11P_35)
HDMI_HPD: U1.J22(IO_L8N_T1_34)
PL_CLK: R81.2
PS_CLK: R39.2 U1.F7(PS_CLK_500)
PS_POR_B: R97.1 U1.B5(PS_POR_B_500) U13.2(RESET#)
PS_SRST: R108.2 U1.C9(PS_SRST_B_501)
PS_UART0_RX: U1.B6(PS_MIO14_500)
PS_UART0_TX: U1.E6(PS_MIO15_500)
SD_CLK: U1.E13(PS_MIO44_501)
SD_D0: U1.E14(PS_MIO40_501)
SD_D2: U1.D8(PS_MIO42_501)
SPI1_CLK: U1.D11(PS_MIO48_501)
SPI1_CS: U1.D13(PS_MIO50_501)
SPI1_MOSI: U1.D12(PS_MIO46_501)
USB_CLK: U1.A9(PS_MIO36_501)
USB_D0: U1.C7(PS_MIO32_501)
USB_D1: U1.G13(PS_MIO33_501)
USB_D2: U1.B12(PS_MIO34_501)
USB_D3: U1.F14(PS_MIO35_501)
USB_D4: U1.A12(PS_MIO28_501)
USB_D6: U1.F13(PS_MIO38_501)
USB_DIR: U1.E8(PS_MIO29_501)
USB_NXT: U1.F9(PS_MIO31_501)
USB_STP: U1.A11(PS_MIO30_501)
NetC106_2: C106.2 R37.1 R38.2 U1.F8(PS_MIO_VREF_501)
NetC186_1: C186.1 U15.1(OSCI) X5.1
NetC187_1: C187.1 U15.2(OSCO) X5.2
NetC188_1: C188.1 U15.8(VDD) VD1.3
NetJP6_1: JP6.1 VD1.1
NetKEY1_2: KEY1.2 U13.3(MR#)
NetR39_1: R39.1 X1.3(OUT)
NetR81_1: R81.1 X2.3(OUT)

Not connected (* = marked no-connect by the designer): U1 A16(IO_L9P_T1_DQS_AD3P_35) A17(IO_L9N_T1_DQS_AD3N_35) A22(IO_L15N_T2_DQS_AD12N_35) B15(IO_L7N_T1_AD2N_35) B16(IO_L8P_T1_AD10P_35) B17(IO_L8N_T1_AD10N_35) C15(IO_L7P_T1_AD2P_35) C17(IO_L11P_T1_SRCC_35) C18(IO_L11N_T1_SRCC_35) C19(IO_L12N_T1_MRCC_35) C20(IO_L14N_T2_AD4N_SRCC_35) C22(IO_L16N_T2_35) D10(PS_MIO52_501) D15(IO_L3N_T0_DQS_AD1N_35) D16(IO_L2P_T0_AD8P_35) D17(IO_L2N_T0_AD8N_35) D18(IO_L12P_T1_MRCC_35) D20(IO_L14P_T2_AD4P_SRCC_35) D22(IO_L16P_T2_35) E15(IO_L3P_T0_DQS_AD1P_35) E16(IO_L1N_T0_AD0N_35) E18(IO_L5N_T0_AD9N_35) E19(IO_L21P_T3_DQS_AD14P_35) E20(IO_L21N_T3_DQS_AD14N_35) F16(IO_L1P_T0_AD0P_35) F17(IO_L6N_T0_VREF_35) F18(IO_L5P_T0_AD9P_35) F19(IO_L20N_T3_AD6N_35) F21(IO_L23P_T3_35) F22(IO_L23N_T3_35) G15(IO_L4P_T0_35) G16(IO_L4N_T0_35) G17(IO_L6P_T0_35) G19(IO_L20P_T3_AD6P_35) G22(IO_L24N_T3_AD15N_35) H17(IO_0_35) H18(IO_25_35) H19(IO_L19P_T3_35) H20(IO_L19N_T3_VREF_35) K18(IO_L7N_T1_34) K19(IO_L11P_T1_SRCC_34) L17(IO_L4P_T0_34) L18(IO_L12P_T1_MRCC_34) M15(IO_L6P_T0_34) M16(IO_L6N_T0_VREF_34) M17(IO_L4N_T0_34) N15(IO_L19P_T3_34) N17(IO_L5P_T0_34) N18(IO_L5N_T0_34) N19(IO_L14P_T2_SRCC_34) N20(IO_L14N_T2_SRCC_34) P15(IO_L19N_T3_VREF_34) P16(IO_L24P_T3_34) P17(IO_L20P_T3_34) P18(IO_L20N_T3_34) R15(IO_25_34) R16(IO_L24N_T3_34) R18(IO_L23P_T3_34) R19(IO_L22P_T3_34) T16(IO_L21P_T3_DQS_34) T17(IO_L21N_T3_DQS_34) T18(IO_L23N_T3_34); U15 3(~{INT})* 7(CLKOUT)*

### Library data of the parts
C106 C107 C160 C172 C186-C188 = C: 无极性贴片电容; 版权归属: 源创客; BOM名称: 无极性贴片电容; 学习资源: www.ooocke.com
JP6 = Header 2: 2P接插件; 版权归属: 源创客; BOM名称: 2P接插件; 学习资源: www.ooocke.com
KEY1 = KEY: 按键; BOM名称: 3x6轻触开关; 版权归属: 源创客; 学习资源: www.ooocke.com
R37-R39 R81 R97 R108 R121 R122 = R: 贴片电阻; 版权归属: 源创客; BOM名称: 贴片电阻; 学习资源: www.ooocke.com
U1 = XC7Z020-2CLG484I: as U1 on sheet 01_DDR3L_256Mx32bits; Name: XC7Z020-2CLG484I; Symbol: XC7Z020-2CLG484I; Device: XC7Z020-2CLG484I; LCSC Part Name: XC7Z020-2CLG484I; Supplier Part: C157624; Manufacturer Part: XC7Z020-2CLG484I; Supplier Footprint: CSPBGA-484; JLCPCB Part Class: Extended Part; Datasheet: https://atta.szlcsc.com/upload/public/pdf/source/20180115/C157624_15160149665121269420.pdf; Supplier: LCSC; Convert to PCB: yes; Assembly Type: smtWeld
U13 = HX811T: Manufacturer: HX(恒佳兴); Add into BOM: yes; Name: HX811T; Symbol: HX811T; Device: HX811T; LCSC Part Name: 检测复位IC  HX811T; Supplier Part: C296128; Manufacturer Part: HX811T; Supplier Footprint: SOT-143; JLCPCB Part Class: Extended Part; Datasheet: https://atta.szlcsc.com/upload/public/pdf/source/20181119/C296128_6509B37C6407C6FF929C4891EE243D12.pdf; Supplier: LCSC; Convert to PCB: yes
VD1 = BAT54C: 肖特基二极管（双）
X1 X2 = XTAL-4P_S: 4脚有源晶振; BOM名称: 4脚晶振; 版权归属: 源创客; 学习资源: www.ooocke.com
X5 = XTAL-2P: 2脚无源晶振; BOM名称: 2脚晶振; 版权归属: 源创客; 学习资源: www.ooocke.com

## Sheet 06_CAN&RS485.SchDoc
size A4; SheetNumber: 7; SheetTotal: 11
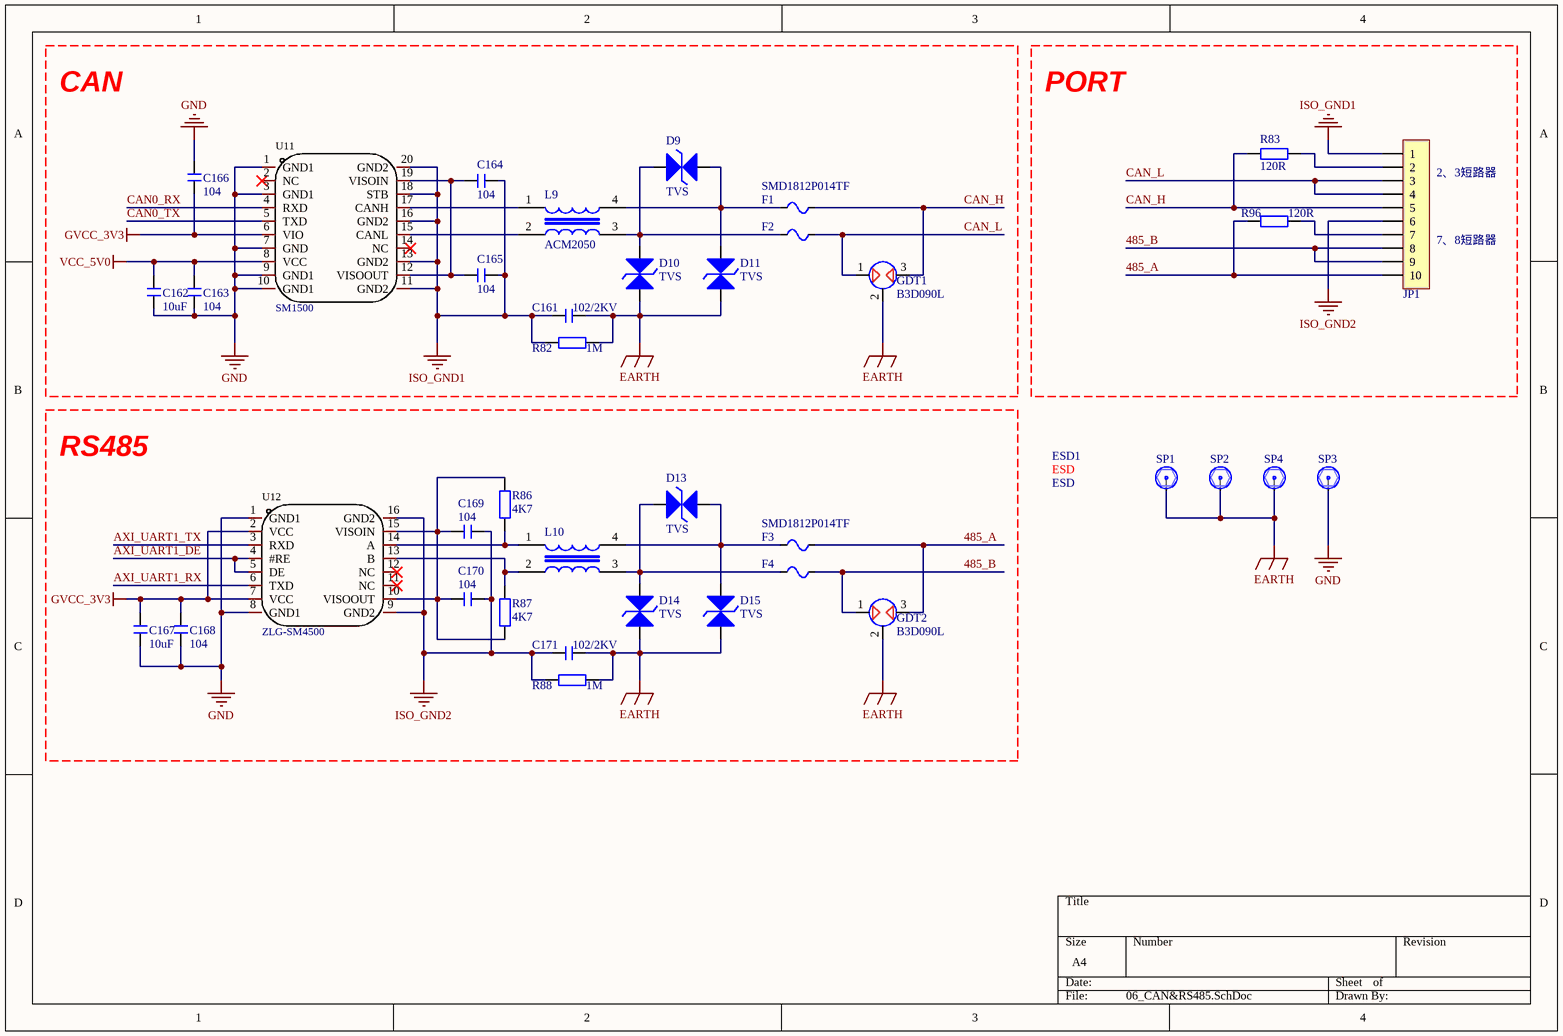
[diagram p5: 06_CAN&RS485.SchDoc]

### Parts
C161  102/2KV  [C 1206]
C162  10uF  [C 0805]
C163  104  [C 0603]
C164  104  [C 0603]
C165  104  [C 0603]
C166  104  [C 0603]
C167  10uF  [C 0805]
C168  104  [C 0603]
C169  104  [C 0603]
C170  104  [C 0603]
C171  102/2KV  [C 1206]
D9  TVS  [SMA]
D10  TVS  [SMA]
D11  TVS  [SMA]
D13  TVS  [SMA]
D14  TVS  [SMA]
D15  TVS  [SMA]
ESD1  ESD  [ESD]
F1  SMD1812P014TF  [PLCC-1812]
F2  SMD1812P014TF  [PLCC-1812]  (value not drawn)
F3  SMD1812P014TF  [PLCC-1812]
F4  SMD1812P014TF  [PLCC-1812]  (value not drawn)
GDT1  B3D090L  [B3D090L]
GDT2  B3D090L  [B3D090L]
JP1  HDR-1X10  [KF2EDGE_3.81_10P]  (value not drawn)
L9  ACM2050  [ACM2520]
L10  共模电感  [ACM2520]  (value not drawn)
R82  1M  [R 1206]
R83  120R  [R 1206]
R86  4K7  [R 0603]
R87  4K7  [R 0603]
R88  1M  [R 1206]
R96  120R  [R 1206]
SP1  M3铜柱  [M3-HOLE]  (value not drawn)
SP2  M3铜柱  [M3-HOLE]  (value not drawn)
SP3  M3铜柱  [M3-HOLE]  (value not drawn)
SP4  M3铜柱  [M3-HOLE]  (value not drawn)
U11  SM1500  [DFN-20_12,5x9.9]
U12  ZLG-SM4500  [DFN-16]

### Nets
EARTH: C161.2 C171.2 D10.1(A) D11.2(K) D14.1(A) D15.2(K) GDT1.2 GDT2.2 R82.2 R88.2 SP1.1 SP2.1 SP4.1
GND: C162.1 C163.1 C166.2 C167.1 C168.1 SP3.1 U11.1(GND1) U11.3(GND1) U11.7(GND) U11.9(GND1) U11.10(GND1) U12.1(GND1) U12.8(GND1)
GVCC_3V3: C166.1 C167.2 C168.2 U11.6(VIO) U12.2(VCC) U12.7(VCC)
ISO_GND1: C161.1 C164.1 C165.2 JP1.1 R82.1 U11.11(GND2) U11.13(GND2) U11.16(GND2) U11.18(STB) U11.20(GND2)
ISO_GND2: C169.2 C170.2 C171.1 JP1.6 R88.1 U12.9(GND2) U12.16(GND2)
VCC_5V0: C162.2 C163.2 U11.8(VCC)
485_A: F3.2 GDT2.3 JP1.10 R96.2
485_B: F4.2 GDT2.1 JP1.8 JP1.9
AXI_UART1_DE: U12.4(#RE) U12.5(DE)
AXI_UART1_RX: U12.6(TXD)
AXI_UART1_TX: U12.3(RXD)
CAN0_RX: U11.4(RXD)
CAN0_TX: U11.5(TXD)
CAN_H: F1.2 GDT1.3 JP1.5 R83.2
CAN_L: F2.2 GDT1.1 JP1.3 JP1.4
NetC164_2: C164.2 C165.1 U11.12(VISOOUT) U11.19(VISOIN)
NetC169_1: C169.1 C170.1 R86.2 R87.1 U12.10(VISOOUT) U12.15(VISOIN)
NetD9_1: D9.1(A) D11.1(A) F1.1 L9.4
NetD9_2: D9.2(K) D10.2(K) F2.1 L9.3
NetD13_1: D13.1(A) D15.1(A) F3.1 L10.4
NetD13_2: D13.2(K) D14.2(K) F4.1 L10.3
NetJP1_2: JP1.2 R83.1
NetJP1_7: JP1.7 R96.1
NetL9_1: L9.1 U11.17(CANH)
NetL9_2: L9.2 U11.15(CANL)
NetL10_1: L10.1 R86.1 U12.14(A)
NetL10_2: L10.2 R87.2 U12.13(B)

Not connected (* = marked no-connect by the designer): U11 2(NC)* 14(NC)*; U12 11(NC)* 12(NC)*

### Notes on the sheet
- CAN
- PORT
- (near JP1) 2、3短路器
- (near JP1) 7、8短路器
- RS485

### Library data of the parts
C161-C171 = C: 无极性贴片电容; 版权归属: 源创客; BOM名称: 无极性贴片电容; 学习资源: www.ooocke.com
ESD1 = ESD: 防静电; BOM名称: 散热片; 版权归属: 源创客; 学习资源: www.ooocke.com
F1-F4 = FU: 贴片保险丝; 版权归属: 源创客; BOM名称: 贴片保险丝; 学习资源: www.ooocke.com
JP1 = Header 10: 10P接插件; 版权归属: 源创客; BOM名称: 10P接插件; 学习资源: www.ooocke.com
L9 = 共模电感
R82 R83 R86-R88 R96 = R: 贴片电阻; 版权归属: 源创客; BOM名称: 贴片电阻; 学习资源: www.ooocke.com
SP1-SP4 = 铜柱大焊盘: 铜柱; 版权归属: 源创客; BOM名称: 铜柱; 学习资源: www.ooocke.com
U11 = SM1500: Manufacturer: ZLG(致远电子); Add into BOM: yes; Name: SM1500; Symbol: SM1500; Device: SM1500; LCSC Part Name: SM1500; Supplier Part: C2879955; Manufacturer Part: SM1500; Supplier Footprint: DFN-20; JLCPCB Part Class: Extended Part; Datasheet: https://atta.szlcsc.com/upload/public/pdf/source/20210825/C2879955_A99A3E3BA6E3BB620860F39BC584C05F.pdf; Supplier: LCSC; Convert to PCB: yes
U12 = ZLG-SM4500: Manufacturer: MORNSUN(金升阳); Name: TD541S485H; Add into BOM: yes; Types: 收发器; Data Rate: 1Mbps; Node Number: 256; Supply Voltage: 5.5V；3.3V; ESD Protect: ±15kV; Whether the isolation: 是; Symbol: TD541S485H; Device: TD541S485H; LCSC Part Name: 3.3V或5.5V供电 1Mbps 带静电保护收发器 MSL=3，上机前请烘烤; Supplier Part: C707458; Manufacturer Part: TD541S485H; Supplier Footprint: DFN-16(10x13); JLCPCB Part Class: Extended Part; Datasheet: https://atta.szlcsc.com/upload/public/pdf/source/20200720/C707457_1DF1C6EE65ECD3D3F30F36237E18355C.pdf; Supplier: LCSC; Convert to PCB: yes; Driver/receiver: -; Operating Temperature: -40℃~+105℃

## Sheet 07_FE_SWITCHING.SchDoc
size A4; SheetNumber: 8; SheetTotal: 11
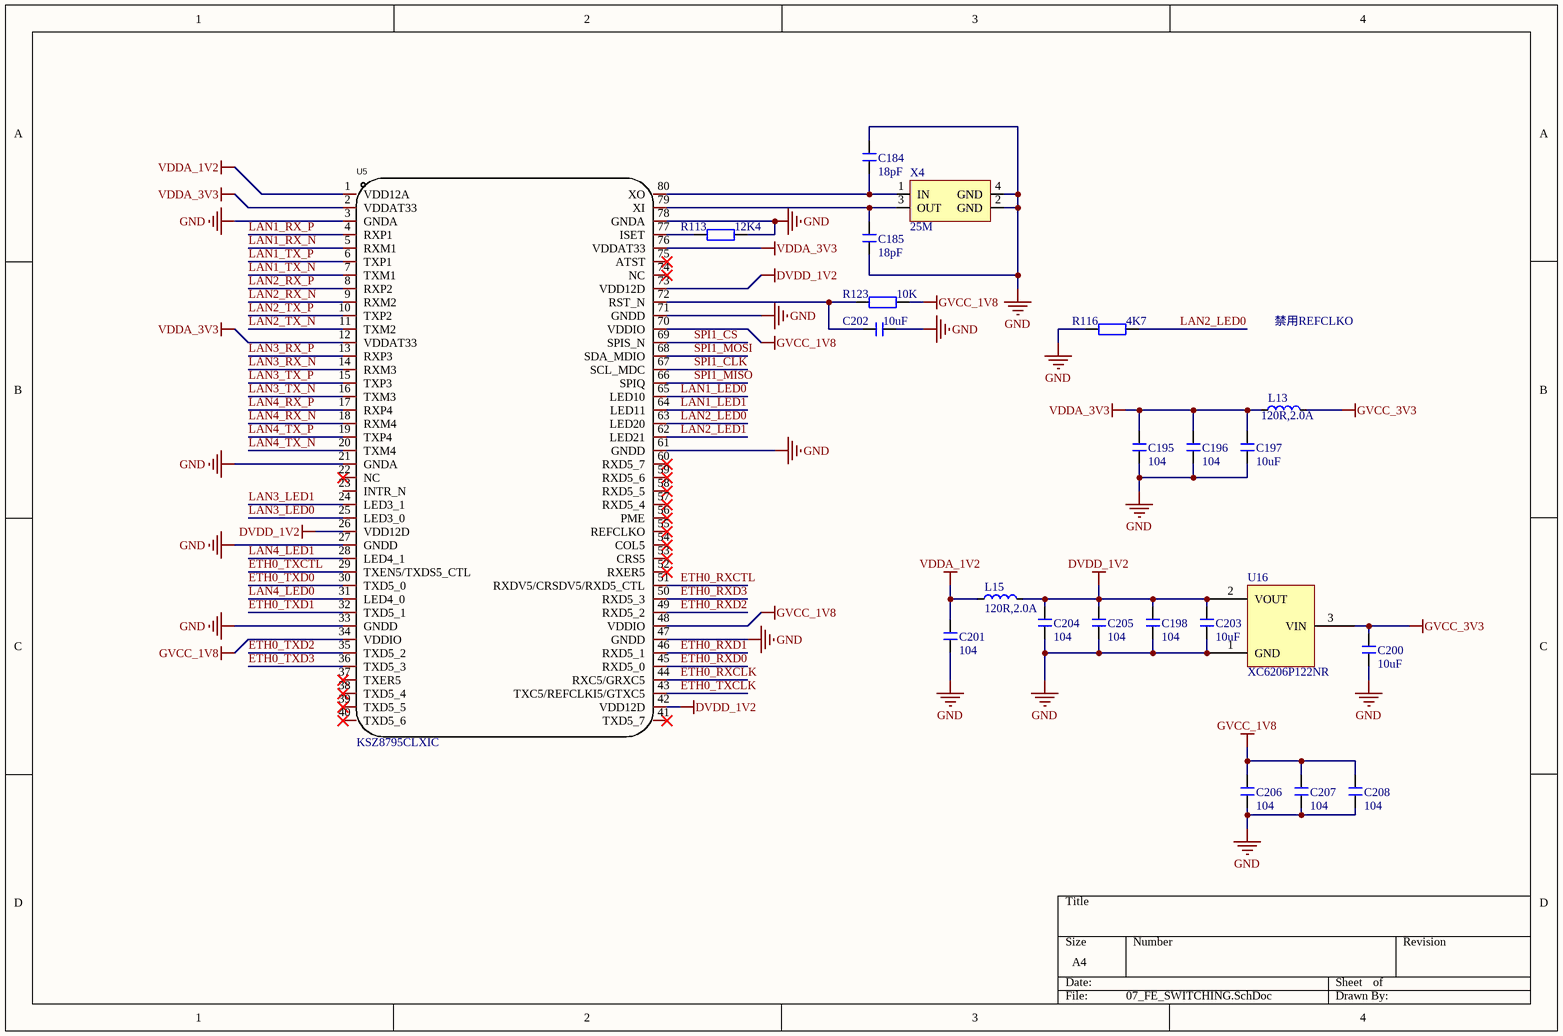
[diagram p6: 07_FE_SWITCHING.SchDoc]

### Parts
C184  18pF  [C 0603]
C185  18pF  [C 0603]
C195  104  [C 0603]
C196  104  [C 0603]
C197  10uF  [C 0603]
C198  104  [C 0603]
C200  10uF  [C 0603]
C201  104  [C 0603]
C202  10uF  [C 0603]
C203  10uF  [C 0603]
C204  104  [C 0603]
C205  104  [C 0603]
C206  104  [C 0603]
C207  104  [C 0603]
C208  104  [C 0603]
L13  120R,2.0A  [L 0603]
L15  120R,2.0A  [L 0603]
R113  12K4  [R 0603]
R116  4K7  [R 0603]
R123  10K  [R 0603]
U5  KSZ8795CLXIC  [LQFP80_10x10]
U16  XC6206P122NR  [SOT23-3M]
X4  25M  [XTAL-3225]

### Nets
DVDD_1V2: C198.2 C203.2 C204.2 C205.2 L15.2 U5.26(VDD12D) U5.42(VDD12D) U5.73(VDD12D) U16.2(VOUT)
GND: C184.2 C185.1 C195.1 C196.1 C197.1 C198.1 C200.1 C201.1 C202.1 C203.1 C204.1 C205.1 C206.1 C207.1 C208.1 R113.2 R116.1 U5.3(GNDA) U5.21(GNDA) U5.27(GNDD) U5.33(GNDD) U5.47(GNDD) U5.61(GNDD) U5.71(GNDD) U5.78(GNDA) U16.1(GND) X4.2(GND) X4.4(GND)
GVCC_1V8: C206.2 C207.2 C208.2 R123.2 U5.34(VDDIO) U5.48(VDDIO) U5.70(VDDIO)
GVCC_3V3: C200.2 L13.2 U16.3(VIN)
VDDA_1V2: C201.2 L15.1 U5.1(VDD12A)
VDDA_3V3: C195.2 C196.2 C197.2 L13.1 U5.2(VDDAT33) U5.12(VDDAT33) U5.76(VDDAT33)
ETH0_RXCLK: U5.44(RXC5/GRXC5)
ETH0_RXCTL: U5.51(RXDV5/CRSDV5/RXD5_CTL)
ETH0_RXD0: U5.45(RXD5_0)
ETH0_RXD1: U5.46(RXD5_1)
ETH0_RXD2: U5.49(RXD5_2)
ETH0_RXD3: U5.50(RXD5_3)
ETH0_TXCLK: U5.43(TXC5/REFCLKI5/GTXC5)
ETH0_TXCTL: U5.29(TXEN5/TXDS5_CTL)
ETH0_TXD0: U5.30(TXD5_0)
ETH0_TXD1: U5.32(TXD5_1)
ETH0_TXD2: U5.35(TXD5_2)
ETH0_TXD3: U5.36(TXD5_3)
LAN1_LED0: U5.65(LED10)
LAN1_LED1: U5.64(LED11)
LAN1_RX_N: U5.5(RXM1)
LAN1_RX_P: U5.4(RXP1)
LAN1_TX_N: U5.7(TXM1)
LAN1_TX_P: U5.6(TXP1)
LAN2_LED0: R116.2 U5.63(LED20)
LAN2_LED1: U5.62(LED21)
LAN2_RX_N: U5.9(RXM2)
LAN2_RX_P: U5.8(RXP2)
LAN2_TX_N: U5.11(TXM2)
LAN2_TX_P: U5.10(TXP2)
LAN3_LED0: U5.25(LED3_0)
LAN3_LED1: U5.24(LED3_1)
LAN3_RX_N: U5.14(RXM3)
LAN3_RX_P: U5.13(RXP3)
LAN3_TX_N: U5.16(TXM3)
LAN3_TX_P: U5.15(TXP3)
LAN4_LED0: U5.31(LED4_0)
LAN4_LED1: U5.28(LED4_1)
LAN4_RX_N: U5.18(RXM4)
LAN4_RX_P: U5.17(RXP4)
LAN4_TX_N: U5.20(TXM4)
LAN4_TX_P: U5.19(TXP4)
SPI1_CLK: U5.67(SCL_MDC)
SPI1_CS: U5.69(SPIS_N)
SPI1_MISO: U5.66(SPIQ)
SPI1_MOSI: U5.68(SDA_MDIO)
NetC184_1: C184.1 U5.80(XO) X4.1(IN)
NetC185_2: C185.2 U5.79(XI) X4.3(OUT)
NetC202_2: C202.2 R123.1 U5.72(RST_N)
NetR113_1: R113.1 U5.77(ISET)

Not connected (* = marked no-connect by the designer): U5 22(NC)* 23(INTR_N) 37(TXER5)* 38(TXD5_4)* 39(TXD5_5)* 40(TXD5_6)* 41(TXD5_7)* 52(RXER5)* 53(CRS5)* 54(COL5)* 55(REFCLKO)* 56(PME)* 57(RXD5_4)* 58(RXD5_5)* 59(RXD5_6)* 60(RXD5_7)* 74(NC)* 75(ATST)*

### Notes on the sheet
- 禁用REFCLKO

### Library data of the parts
C184 C185 C195-C198 C200-C208 = C: 无极性贴片电容; 版权归属: 源创客; BOM名称: 无极性贴片电容; 学习资源: www.ooocke.com
L13 L15 = L: 小功率贴片电感磁珠; 版权归属: 源创客; BOM名称: 小功率贴片电感; 学习资源: www.ooocke.com
R113 R116 R123 = R: 贴片电阻; 版权归属: 源创客; BOM名称: 贴片电阻; 学习资源: www.ooocke.com
U5 = KSZ8795CLXIC: Manufacturer: MICROCHIP(美国微芯); Add into BOM: yes; Application Function: 交换机; Number of Channels: 5; Interface: MII；RMII; Supply Voltage: 3.3V; Name: KSZ8795CLXIC; Symbol: KSZ8795CLXIC; Device: KSZ8795CLXIC; LCSC Part Name: KSZ8795CLXIC; Supplier Part: C69416; Manufacturer Part: KSZ8795CLXIC; Supplier Footprint: LQFP-80(10x10); JLCPCB Part Class: Extended Part; Datasheet: https://atta.szlcsc.com/upload/public/pdf/source/20160723/1469258974576.pdf; Supplier: LCSC; Convert to PCB: yes; Operating Temperature: -40℃~+85℃
U16 = XC6206-1.8NR
X4 = XTAL-4P: 4脚无源晶振; BOM名称: 4脚晶振; 版权归属: 源创客; 学习资源: www.ooocke.com

## Sheet 08_HDMI.SchDoc
size A4; SheetNumber: 9; SheetTotal: 11
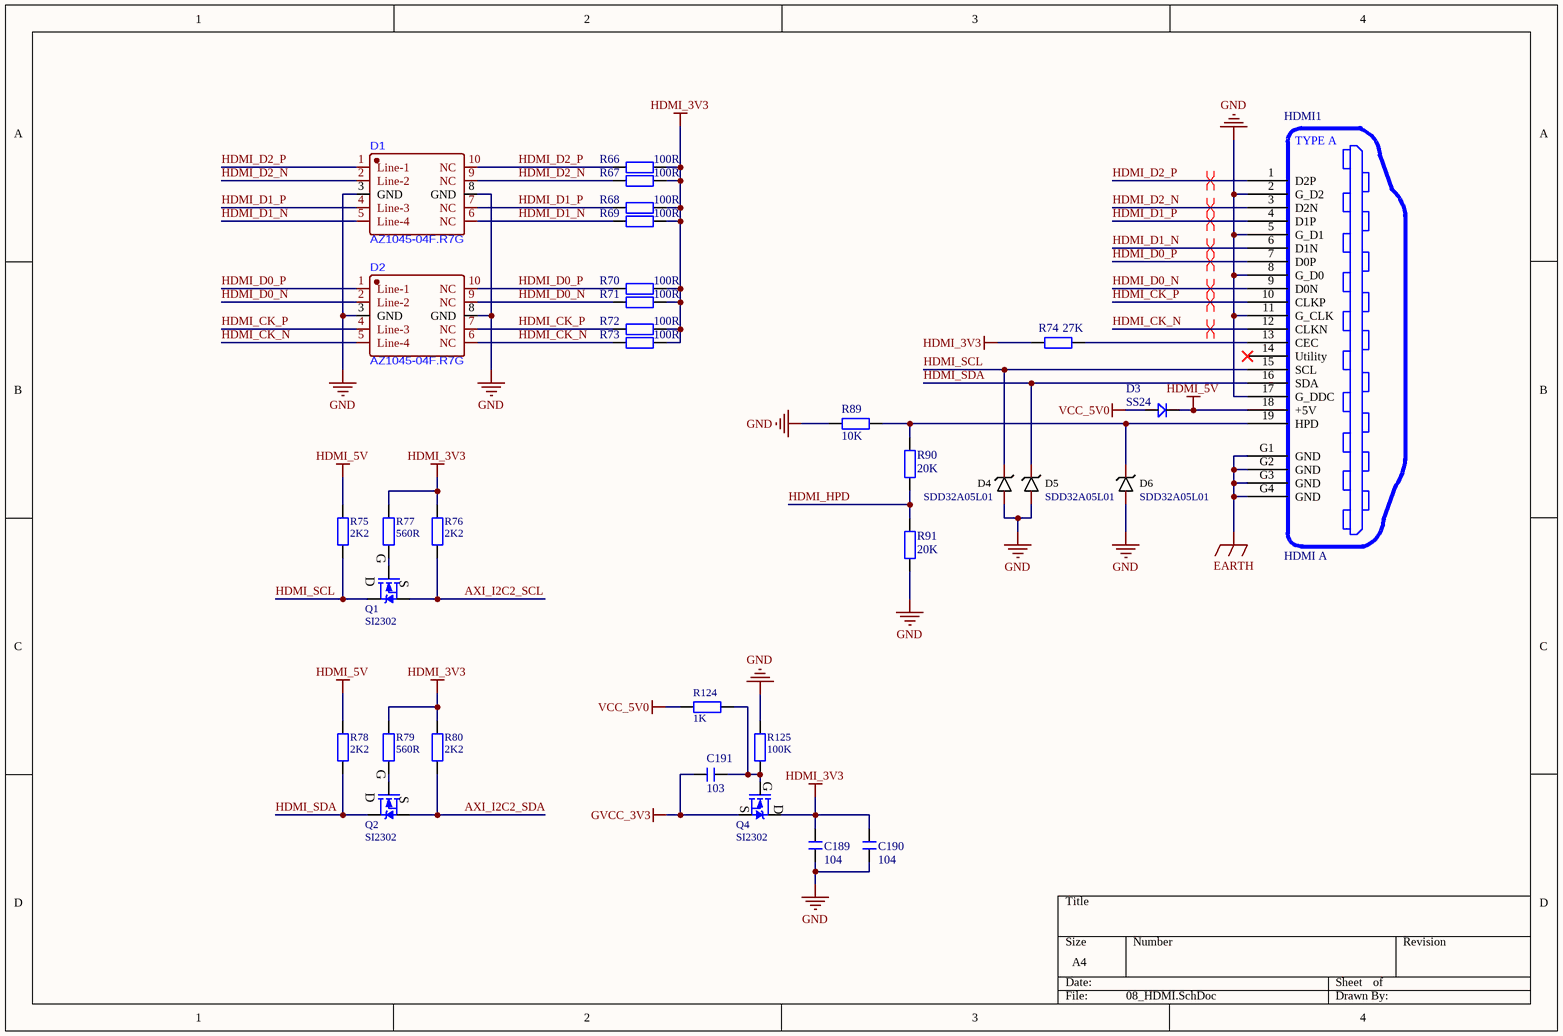
[diagram p7: 08_HDMI.SchDoc]

### Parts
C189  104  [C 0603]
C190  104  [C 0603]
C191  103  [C 0603]
D1  AZ1045-04F.R7G  [AZ1045-04F]
D2  AZ1045-04F.R7G  [AZ1045-04F]
D3  SS24  [SMA]
D4  SDD32A05L01  [SOD-323]
D5  SDD32A05L01  [SOD-323]
D6  SDD32A05L01  [SOD-323]
HDMI1  HDMI A  [HDMI-A]
Q1  SI2302  [SOT23-3L]
Q2  SI2302  [SOT23-3L]
Q4  SI2302  [SOT23-3L]
R66  100R  [R 0402]
R67  100R  [R 0402]
R68  100R  [R 0402]
R69  100R  [R 0402]
R70  100R  [R 0402]
R71  100R  [R 0402]
R72  100R  [R 0402]
R73  100R  [R 0402]
R74  27K  [R 0402]
R75  2K2  [R 0603]
R76  2K2  [R 0603]
R77  560R  [R 0603]
R78  2K2  [R 0603]
R79  560R  [R 0603]
R80  2K2  [R 0603]
R89  10K  [R 0603]
R90  20K  [R 0603]
R91  20K  [R 0603]
R124  1K  [R 0603]
R125  100K  [R 0603]

### Nets
EARTH: HDMI1.G1(GND) HDMI1.G2(GND) HDMI1.G3(GND) HDMI1.G4(GND)
GND: C189.1 C190.1 D1.3(GND) D1.8(GND) D2.3(GND) D2.8(GND) D4.2(A) D5.2(A) D6.2(A) HDMI1.2(G_D2) HDMI1.5(G_D1) HDMI1.8(G_D0) HDMI1.11(G_CLK) HDMI1.17(G_DDC) R89.1 R91.1 R125.2
GVCC_3V3: C191.1 Q4.2(S)
HDMI_3V3: C189.2 C190.2 Q4.3(D) R66.2 R67.2 R68.2 R69.2 R70.2 R71.2 R72.2 R73.2 R74.1 R76.2 R77.2 R79.2 R80.2
HDMI_5V: D3.2(K) HDMI1.18(+5V) R75.2 R78.2
VCC_5V0: D3.1(A) R124.2
AXI_I2C2_SCL: Q1.2(S) R76.1
AXI_I2C2_SDA: Q2.2(S) R80.1
HDMI_CK_N: D2.5(Line-4) D2.6(NC) HDMI1.12(CLKN) R73.1
HDMI_CK_P: D2.4(Line-3) D2.7(NC) HDMI1.10(CLKP) R72.1
HDMI_D0_N: D2.2(Line-2) D2.9(NC) HDMI1.9(D0N) R71.1
HDMI_D0_P: D2.1(Line-1) D2.10(NC) HDMI1.7(D0P) R70.1
HDMI_D1_N: D1.5(Line-4) D1.6(NC) HDMI1.6(D1N) R69.1
HDMI_D1_P: D1.4(Line-3) D1.7(NC) HDMI1.4(D1P) R68.1
HDMI_D2_N: D1.2(Line-2) D1.9(NC) HDMI1.3(D2N) R67.1
HDMI_D2_P: D1.1(Line-1) D1.10(NC) HDMI1.1(D2P) R66.1
HDMI_HPD: R90.1 R91.2
HDMI_SCL: D4.1(C) HDMI1.15(SCL) Q1.3(D) R75.1
HDMI_SDA: D5.1(C) HDMI1.16(SDA) Q2.3(D) R78.1
NetC191_2: C191.2 Q4.1(G) R124.1 R125.1
NetD6_1: D6.1(C) HDMI1.19(HPD) R89.2 R90.2
NetHDMI1_13: HDMI1.13(CEC) R74.2
NetQ1_1: Q1.1(G) R77.1
NetQ2_1: Q2.1(G) R79.1

Not connected (* = marked no-connect by the designer): HDMI1 14(Utility)*

### Layout directives
differential pair: HDMI_CK_N, HDMI_CK_P, HDMI_D0_N, HDMI_D0_P, HDMI_D1_N, HDMI_D1_P, HDMI_D2_N, HDMI_D2_P

### Notes on the sheet
- (in symbol HDMI-A-19P) TYPE A

### Library data of the parts
C189-C191 = C: 无极性贴片电容; 版权归属: 源创客; BOM名称: 无极性贴片电容; 学习资源: www.ooocke.com
D3 = SS14: 肖特基二极管; 版权归属: 源创客; 属性: 40V/1A; BOM名称: 肖特基二极管; 学习资源: www.ooocke.com
D4-D6 = SDD32A05L01: Manufacturer: Brightking(君耀电子); Add into BOM: yes; Polarity: 单向; Number of Lines: 1; Reverse Stand-Off Voltage (Vrwm): 5V; Breakdown Voltage (VBR): 6V; Peak Pulse Current(Ipp)@8/20us: 24A; Clamping Voltage@Ipp: 9.8V; Name: SDD32A05L01; Symbol: SDD32A05L01; Device: SDD32A05L01; LCSC Part Name: 单向ESD; Supplier Part: C313305; Manufacturer Part: SDD32A05L01; Supplier Footprint: SOD-323; JLCPCB Part Class: Extended Part; Datasheet: https://atta.szlcsc.com/upload/public/pdf/source/20181015/C313305_BF914637BD71FE225247645F09645EA8.pdf; Supplier: LCSC; Convert to PCB: yes
HDMI1 = HDMI-A-19P: HDMI座子
Q1 Q2 Q4 = SI2302: N沟道场效应管; 版权归属: 源创客; BOM名称: N沟道场效应管; 学习资源: www.ooocke.com
R66-R80 R89-R91 R124 R125 = R: 贴片电阻; 版权归属: 源创客; BOM名称: 贴片电阻; 学习资源: www.ooocke.com

## Sheet 09_TFCARD&USB2.0.SchDoc
size A4; SheetNumber: 10; SheetTotal: 11
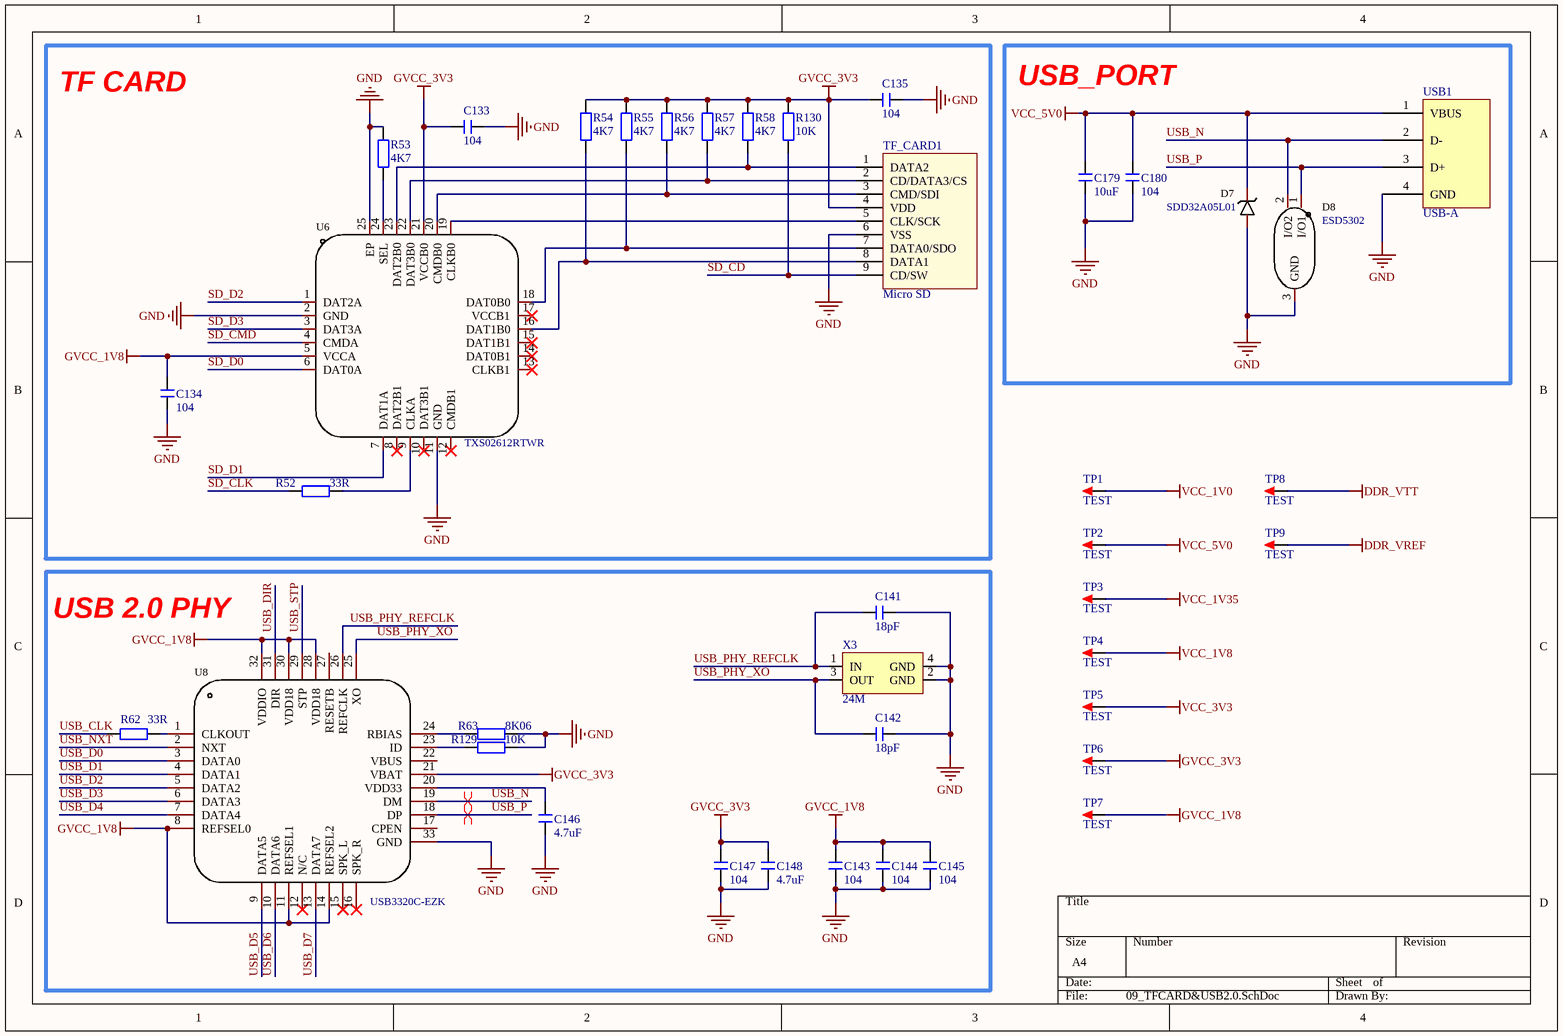
[diagram p8: 09_TFCARD&USB2.0.SchDoc]

### Parts
C133  104  [C 0603]
C134  104  [C 0603]
C135  104  [C 0603]
C141  18pF  [C 0603]
C142  18pF  [C 0603]
C143  104  [C 0603]
C144  104  [C 0603]
C145  104  [C 0603]
C146  4.7uF  [C 0603]
C147  104  [C 0603]
C148  4.7uF  [C 0603]
C179  10uF  [C 0805]
C180  104  [C 0603]
D7  SDD32A05L01  [SOD-323]
D8  ESD5302  [SOT23-3M]
R52  33R  [R 0603]
R53  4K7  [R 0603]
R54  4K7  [R 0603]
R55  4K7  [R 0603]
R56  4K7  [R 0603]
R57  4K7  [R 0603]
R58  4K7  [R 0603]
R62  33R  [R 0603]
R63  8K06  [R 0603]
R129  10K  [R 0603]
R130  10K  [R 0603]
TF_CARD1  Micro SD  [Micro SD]
TP1  TEST  [TEST 1]
TP2  TEST  [TEST 1]
TP3  TEST  [TEST 1]
TP4  TEST  [TEST 1]
TP5  TEST  [TEST 1]
TP6  TEST  [TEST 1]
TP7  TEST  [TEST 1]
TP8  TEST  [TEST 1]
TP9  TEST  [TEST 1]
U6  TXS02612RTWR  [QFN24 4x4_N]
U8  USB3320C-EZK  [QFN32 5x5_L]
USB1  USB-A  [USB-Short]
X3  24M  [XTAL-3225]

### Blocks framed on the sheet
TF CARD: C133-C135 R52-R58 R130 TF_CARD1 U6
USB_PORT: C179 C180 D7 D8 USB1
USB 2.0 PHY: C141-C148 R62 R63 R129 U8 X3

### Nets
DDR_VREF: TP9.1
DDR_VTT: TP8.1
GND: C133.1 C134.1 C135.2 C141.1 C142.1 C143.1 C144.1 C145.1 C146.1 C147.1 C148.1 C179.1 C180.1 D7.2(A) D8.3(GND) R53.2 R63.2 R129.2 TF_CARD1.6(VSS) U6.2(GND) U6.11(GND) U6.25(EP) U8.33(GND) USB1.4(GND) X3.2(GND) X3.4(GND)
GVCC_1V8: C134.2 C143.2 C144.2 C145.2 TP7.1 U6.5(VCCA) U8.8(REFSEL0) U8.11(REFSEL1) U8.14(REFSEL2) U8.28(VDD18) U8.30(VDD18) U8.32(VDDIO)
GVCC_3V3: C133.2 C135.1 C147.2 C148.2 R54.2 R55.2 R56.2 R57.2 R58.2 R130.2 TF_CARD1.4(VDD) TP6.1 U6.21(VCCB0) U8.21(VBAT)
VCC_1V0: TP1.1
VCC_1V8: TP4.1
VCC_1V35: TP3.1
VCC_3V3: TP5.1
VCC_5V0: C179.2 C180.2 D7.1(C) TP2.1 USB1.1(VBUS)
SD_CD: R130.1 TF_CARD1.9(CD/SW)
SD_CLK: R52.1
SD_CMD: U6.4(CMDA)
SD_D0: U6.6(DAT0A)
SD_D1: U6.7(DAT1A)
SD_D2: U6.1(DAT2A)
SD_D3: U6.3(DAT3A)
USB_CLK: R62.2
USB_D0: U8.3(DATA0)
USB_D1: U8.4(DATA1)
USB_D2: U8.5(DATA2)
USB_D3: U8.6(DATA3)
USB_D4: U8.7(DATA4)
USB_D5: U8.9(DATA5)
USB_D6: U8.10(DATA6)
USB_D7: U8.13(DATA7)
USB_DIR: U8.31(DIR)
USB_N: D8.2(I/O2) U8.19(DM) USB1.2(D-)
USB_NXT: U8.2(NXT)
USB_P: D8.1(I/O1) U8.18(DP) USB1.3(D+)
USB_PHY_REFCLK: C141.2 U8.26(REFCLK) X3.1(IN)
USB_PHY_XO: C142.2 U8.25(XO) X3.3(OUT)
USB_STP: U8.29(STP)
NetC146_2: C146.2 U8.20(VDD33)
NetR52_2: R52.2 U6.9(CLKA)
NetR53_1: R53.1 U6.24(SEL)
NetR54_1: R54.1 TF_CARD1.8(DATA1) U6.16(DAT1B0)
NetR55_1: R55.1 TF_CARD1.7(DATA0/SDO) U6.18(DAT0B0)
NetR56_1: R56.1 TF_CARD1.3(CMD/SDI) U6.20(CMDB0)
NetR57_1: R57.1 TF_CARD1.2(CD/DATA3/CS) U6.22(DAT3B0)
NetR58_1: R58.1 TF_CARD1.1(DATA2) U6.23(DAT2B0)
NetR62_1: R62.1 U8.1(CLKOUT)
NetR63_1: R63.1 U8.24(RBIAS)
NetR129_1: R129.1 U8.23(ID)
NetTF_CARD1_5: TF_CARD1.5(CLK/SCK) U6.19(CLKB0)

Not connected (* = marked no-connect by the designer): U6 8(DAT2B1)* 10(DAT3B1)* 12(CMDB1)* 13(CLKB1)* 14(DAT0B1)* 15(DAT1B1)* 17(VCCB1)*; U8 12(N/C)* 15(SPK_L)* 16(SPK_R)* 17(CPEN) 22(VBUS) 27(RESETB)

### Layout directives
differential pair: USB_N, USB_P

### Library data of the parts
C133-C135 C141-C148 C179 C180 = C: 无极性贴片电容; 版权归属: 源创客; BOM名称: 无极性贴片电容; 学习资源: www.ooocke.com
D7 = SDD32A05L01: as D4 on sheet 08_HDMI; Name: SDD32A05L01; Symbol: SDD32A05L01; Device: SDD32A05L01; LCSC Part Name: 单向ESD; Supplier Part: C313305; Manufacturer Part: SDD32A05L01; Supplier Footprint: SOD-323; JLCPCB Part Class: Extended Part; Datasheet: https://atta.szlcsc.com/upload/public/pdf/source/20181015/C313305_BF914637BD71FE225247645F09645EA8.pdf; Supplier: LCSC; Convert to PCB: yes
D8 = ESD5302: Manufacturer: MSKSEMI(美森科); Name: ESD5302F-MS; Add into BOM: yes; Symbol: ESD5302F-MS; Device: ESD5302F-MS; LCSC Part Name: TVS管 W02F; Supplier Part: C2836381; Manufacturer Part: ESD5302F-MS; Supplier Footprint: SOT-23(TO-236); JLCPCB Part Class: Extended Part; Datasheet: https://atta.szlcsc.com/upload/public/pdf/source/20210623/C2836381_4BDAA47FAEBAACD9684711FE62D912DD.pdf; Supplier: LCSC; Convert to PCB: yes
R52-R58 R62 R63 R129 R130 = R: 贴片电阻; 版权归属: 源创客; BOM名称: 贴片电阻; 学习资源: www.ooocke.com
TF_CARD1 = Micro SD: Micro SD卡; 版权归属: 源创客; BOM名称: Micro SD卡; 学习资源: www.ooocke.com
TP1-TP9 = TEST: 测试点; 版权归属: 源创客; BOM名称: 测试点; 学习资源: www.ooocke.com
U6 = TXS02612RTWR: Manufacturer: TI(德州仪器); Add into BOM: yes; Name: TXS02612RTWR; Symbol: TXS02612RTWR; Device: TXS02612RTWR; LCSC Part Name: TXS02612RTWR; Supplier Part: C140276; Manufacturer Part: TXS02612RTWR; Supplier Footprint: QFN-24-EP(4x4); JLCPCB Part Class: Extended Part; Datasheet: https://www.ti.com/cn/lit/gpn/txs02612; Supplier: LCSC; Convert to PCB: yes
U8 = USB3320C-EZK: Manufacturer: MICROCHIP(美国微芯); Add into BOM: yes; Applications Function: 收发器; Protocol: USB 2.0; Supply Voltage: 1.8V~3.3V; Name: USB3320C-EZK; Symbol: USB3320C-EZK; Device: USB3320C-EZK; LCSC Part Name: 高度集成全功能高速usb2.0 ULPI收发器; Supplier Part: C52447; Manufacturer Part: USB3320C-EZK; Supplier Footprint: QFN-32-EP(5x5); JLCPCB Part Class: Extended Part; Datasheet: https://atta.szlcsc.com/upload/public/pdf/source/20210326/C52447_82C15BC01EB7B75485FAEA128A6533A1.pdf; Supplier: LCSC; Convert to PCB: yes; Operating Temperature: -40℃~+85℃
X3 = XTAL-4P: 4脚无源晶振; BOM名称: 4脚晶振; 版权归属: 源创客; 学习资源: www.ooocke.com